# EAGLE design isg-clock-generator-rev1 (EAGLE 9.3.2)
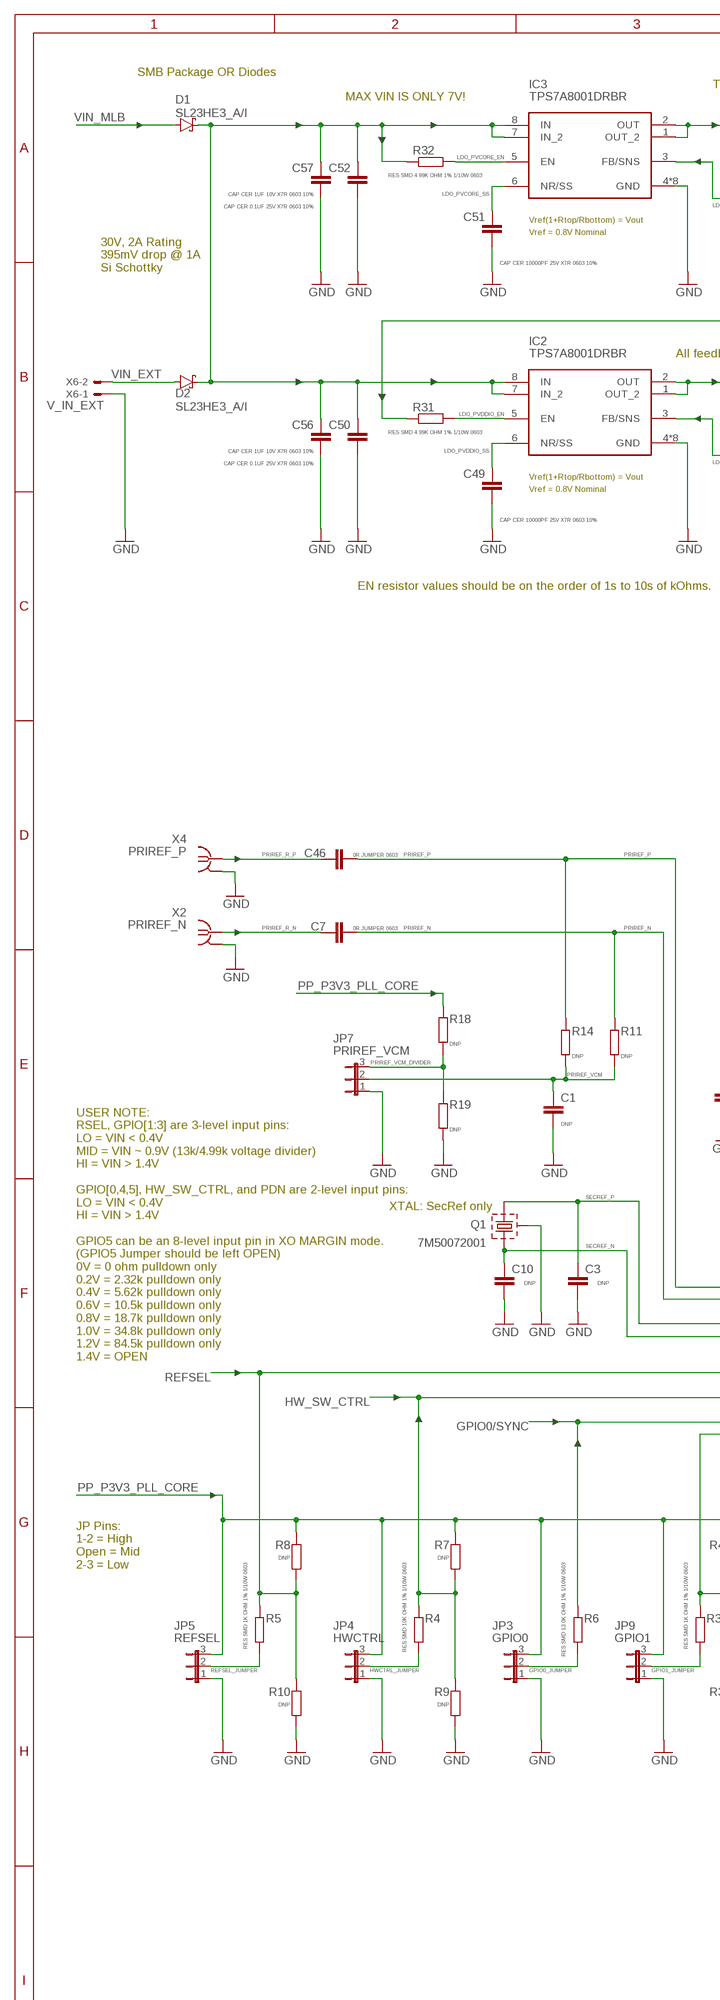
[diagram p0: schematic, sheet 1, part 1 of 2]
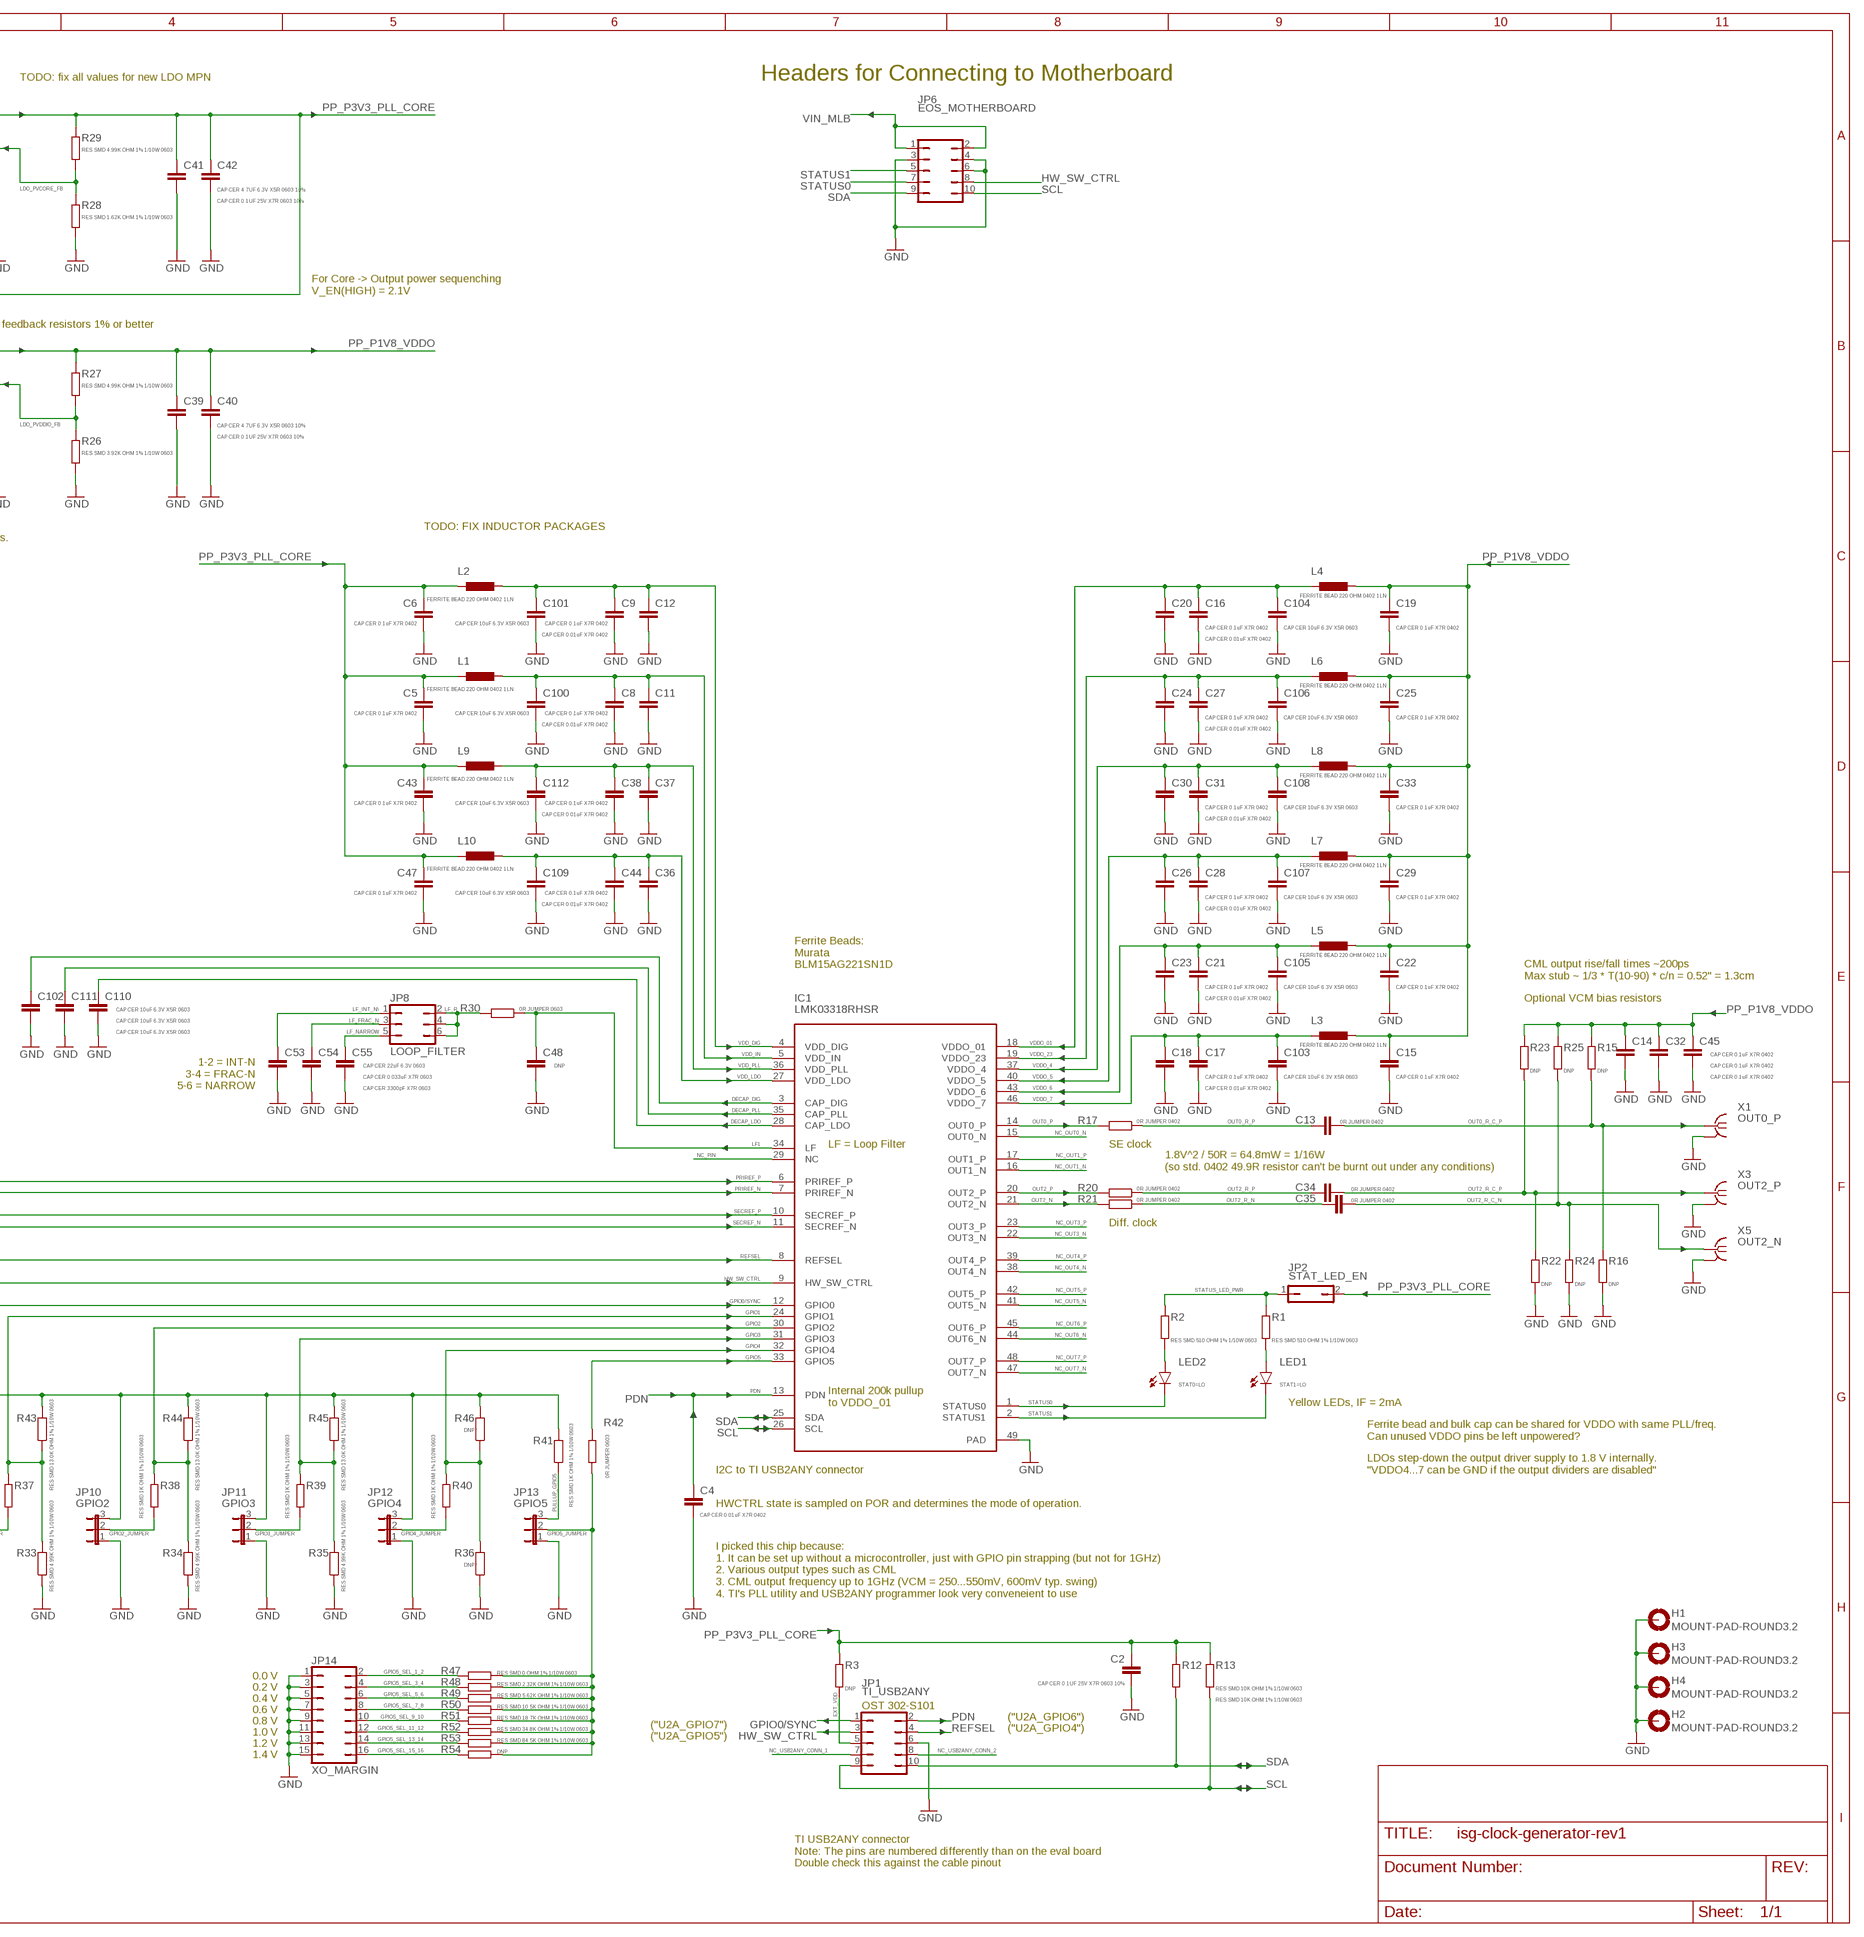
[diagram p1: schematic, sheet 1, part 2 of 2]

## Parts
C1  DNP  C-EUC0603  [C0603]
C2  CAP CER 0.1UF 25V X7R 0603 10%  C-EUC0603  [C0603]
C3  DNP  C-EUC0603  [C0603]
C4  CAP CER 0.01uF X7R 0402  C-EUC0402  [C0402]
C5  CAP CER 0.1uF X7R 0402  C-EUC0402  [C0402]
C6  CAP CER 0.1uF X7R 0402  C-EUC0402  [C0402]
C7  0R JUMPER 0603  C-EUC0603  [C0603]
C8  CAP CER 0.1uF X7R 0402  C-EUC0402  [C0402]
C9  CAP CER 0.1uF X7R 0402  C-EUC0402  [C0402]
C10  DNP  C-EUC0603  [C0603]
C11  CAP CER 0.01uF X7R 0402  C-EUC0402  [C0402]
C12  CAP CER 0.01uF X7R 0402  C-EUC0402  [C0402]
C13  0R JUMPER 0402  C-EUC0402  [C0402]
C14  CAP CER 0.1uF X7R 0402  C-EUC0402  [C0402]
C15  CAP CER 0.1uF X7R 0402  C-EUC0402  [C0402]
C16  CAP CER 0.1uF X7R 0402  C-EUC0402  [C0402]
C17  CAP CER 0.1uF X7R 0402  C-EUC0402  [C0402]
C18  CAP CER 0.01uF X7R 0402  C-EUC0402  [C0402]
C19  CAP CER 0.1uF X7R 0402  C-EUC0402  [C0402]
C20  CAP CER 0.01uF X7R 0402  C-EUC0402  [C0402]
C21  CAP CER 0.1uF X7R 0402  C-EUC0402  [C0402]
C22  CAP CER 0.1uF X7R 0402  C-EUC0402  [C0402]
C23  CAP CER 0.01uF X7R 0402  C-EUC0402  [C0402]
C24  CAP CER 0.01uF X7R 0402  C-EUC0402  [C0402]
C25  CAP CER 0.1uF X7R 0402  C-EUC0402  [C0402]
C26  CAP CER 0.01uF X7R 0402  C-EUC0402  [C0402]
C27  CAP CER 0.1uF X7R 0402  C-EUC0402  [C0402]
C28  CAP CER 0.1uF X7R 0402  C-EUC0402  [C0402]
C29  CAP CER 0.1uF X7R 0402  C-EUC0402  [C0402]
C30  CAP CER 0.01uF X7R 0402  C-EUC0402  [C0402]
C31  CAP CER 0.1uF X7R 0402  C-EUC0402  [C0402]
C32  CAP CER 0.1uF X7R 0402  C-EUC0402  [C0402]
C33  CAP CER 0.1uF X7R 0402  C-EUC0402  [C0402]
C34  0R JUMPER 0402  C-EUC0402  [C0402]
C35  0R JUMPER 0402  C-EUC0402  [C0402]
C36  CAP CER 0.01uF X7R 0402  C-EUC0402  [C0402]
C37  CAP CER 0.01uF X7R 0402  C-EUC0402  [C0402]
C38  CAP CER 0.1uF X7R 0402  C-EUC0402  [C0402]
C39  CAP CER 0.1UF 25V X7R 0603 10%  C-EUC0603  [C0603]
C40  CAP CER 4.7UF 6.3V X5R 0603 10%  C-EUC0603  [C0603]
C41  CAP CER 0.1UF 25V X7R 0603 10%  C-EUC0603  [C0603]
C42  CAP CER 4.7UF 6.3V X5R 0603 10%  C-EUC0603  [C0603]
C43  CAP CER 0.1uF X7R 0402  C-EUC0402  [C0402]
C44  CAP CER 0.1uF X7R 0402  C-EUC0402  [C0402]
C45  CAP CER 0.1uF X7R 0402  C-EUC0402  [C0402]
C46  0R JUMPER 0603  C-EUC0603  [C0603]
C47  CAP CER 0.1uF X7R 0402  C-EUC0402  [C0402]
C48  DNP  C-EUC0603  [C0603]
C49  CAP CER 10000PF 25V X7R 0603 10%  C-EUC0603  [C0603]
C50  CAP CER 0.1UF 25V X7R 0603 10%  C-EUC0603  [C0603]
C51  CAP CER 10000PF 25V X7R 0603 10%  C-EUC0603  [C0603]
C52  CAP CER 0.1UF 25V X7R 0603 10%  C-EUC0603  [C0603]
C53  CAP CER 3300pF X7R 0603  C-EUC0603  [C0603]
C54  CAP CER 0.033uF X7R 0603  C-EUC0603  [C0603]
C55  CAP CER 22uF 6.3V 0603  C-EUC0603  [C0603]
C56  CAP CER 1UF 10V X7R 0603 10%  C-EUC0603  [C0603]
C57  CAP CER 1UF 10V X7R 0603 10%  C-EUC0603  [C0603]
C100  CAP CER 10uF 6.3V X5R 0603  C-EUC0603  [C0603]
C101  CAP CER 10uF 6.3V X5R 0603  C-EUC0603  [C0603]
C102  CAP CER 10uF 6.3V X5R 0603  C-EUC0603  [C0603]
C103  CAP CER 10uF 6.3V X5R 0603  C-EUC0603  [C0603]
C104  CAP CER 10uF 6.3V X5R 0603  C-EUC0603  [C0603]
C105  CAP CER 10uF 6.3V X5R 0603  C-EUC0603  [C0603]
C106  CAP CER 10uF 6.3V X5R 0603  C-EUC0603  [C0603]
C107  CAP CER 10uF 6.3V X5R 0603  C-EUC0603  [C0603]
C108  CAP CER 10uF 6.3V X5R 0603  C-EUC0603  [C0603]
C109  CAP CER 10uF 6.3V X5R 0603  C-EUC0603  [C0603]
C110  CAP CER 10uF 6.3V X5R 0603  C-EUC0603  [C0603]
C111  CAP CER 10uF 6.3V X5R 0603  C-EUC0603  [C0603]
C112  CAP CER 10uF 6.3V X5R 0603  C-EUC0603  [C0603]
D1  SL23HE3_A/I  SCHOTTKY-DIODESMD  [SMB]
D2  SL23HE3_A/I  SCHOTTKY-DIODESMD  [SMB]
H1  MOUNT-PAD-ROUND3.2  [3,2-PAD]
H2  MOUNT-PAD-ROUND3.2  [3,2-PAD]
H3  MOUNT-PAD-ROUND3.2  [3,2-PAD]
H4  MOUNT-PAD-ROUND3.2  [3,2-PAD]
IC1  LMK03318RHSR  LMK03318RHSRRHS0048A_NV  [RHS0048A_NV]
IC2  TPS7A8001DRBR  [DRB8_1P75X1P5]
IC3  TPS7A8001DRBR  [DRB8_1P75X1P5]
JP1  TI_USB2ANY  CON_OST_302-S101  [CON_OST_302-S101]
JP2  STAT_LED_EN  JP1Q  [JP1]
JP3  GPIO0  JP2E  [JP2_ROUND]
JP4  HWCTRL  JP2E  [JP2_ROUND]
JP5  REFSEL  JP2E  [JP2_ROUND]
JP6  EOS_MOTHERBOARD  JP5Q  [JP5Q]
JP7  PRIREF_VCM  JP2E  [JP2_ROUND]
JP8  LOOP_FILTER  JP3Q  [JP3Q]
JP9  GPIO1  JP2E  [JP2_ROUND]
JP10  GPIO2  JP2E  [JP2_ROUND]
JP11  GPIO3  JP2E  [JP2_ROUND]
JP12  GPIO4  JP2E  [JP2_ROUND]
JP13  GPIO5  JP2E  [JP2_ROUND]
JP14  XO_MARGIN  JP8Q  [JP8Q]
L1  FERRITE BEAD 220 OHM 0402 1LN  INDUCTOR0402  [R0402]
L2  FERRITE BEAD 220 OHM 0402 1LN  INDUCTOR0402  [R0402]
L3  FERRITE BEAD 220 OHM 0402 1LN  INDUCTOR0402  [R0402]
L4  FERRITE BEAD 220 OHM 0402 1LN  INDUCTOR0402  [R0402]
L5  FERRITE BEAD 220 OHM 0402 1LN  INDUCTOR0402  [R0402]
L6  FERRITE BEAD 220 OHM 0402 1LN  INDUCTOR0402  [R0402]
L7  FERRITE BEAD 220 OHM 0402 1LN  INDUCTOR0402  [R0402]
L8  FERRITE BEAD 220 OHM 0402 1LN  INDUCTOR0402  [R0402]
L9  FERRITE BEAD 220 OHM 0402 1LN  INDUCTOR0402  [R0402]
L10  FERRITE BEAD 220 OHM 0402 1LN  INDUCTOR0402  [R0402]
LED1  STAT1=LO  LEDCHIP-LED0805  [CHIP-LED0805]
LED2  STAT0=LO  LEDCHIP-LED0805  [CHIP-LED0805]
Q1  7M50072001  KX-7  [3.2X2.5_KX-7]
R1  RES SMD 510 OHM 1% 1/10W 0603  R-EU_R0603  [R0603]
R2  RES SMD 510 OHM 1% 1/10W 0603  R-EU_R0603  [R0603]
R3  DNP  R-EU_R0603  [R0603]
R4  RES SMD 10K OHM 1% 1/10W 0603  R-EU_R0603  [R0603]
R5  RES SMD 1K OHM 1% 1/10W 0603  R-EU_R0603  [R0603]
R6  RES SMD 13.0K OHM 1% 1/10W 0603  R-EU_R0603  [R0603]
R7  DNP  R-EU_R0603  [R0603]
R8  DNP  R-EU_R0603  [R0603]
R9  DNP  R-EU_R0603  [R0603]
R10  DNP  R-EU_R0603  [R0603]
R11  DNP  R-EU_R0603  [R0603]
R12  RES SMD 10K OHM 1% 1/10W 0603  R-EU_R0603  [R0603]
R13  RES SMD 10K OHM 1% 1/10W 0603  R-EU_R0603  [R0603]
R14  DNP  R-EU_R0603  [R0603]
R15  DNP  R-EU_R0402  [R0402]
R16  DNP  R-EU_R0402  [R0402]
R17  0R JUMPER 0402  R-EU_R0402  [R0402]
R18  DNP  R-EU_R0603  [R0603]
R19  DNP  R-EU_R0603  [R0603]
R20  0R JUMPER 0402  R-EU_R0402  [R0402]
R21  0R JUMPER 0402  R-EU_R0402  [R0402]
R22  DNP  R-EU_R0402  [R0402]
R23  DNP  R-EU_R0402  [R0402]
R24  DNP  R-EU_R0402  [R0402]
R25  DNP  R-EU_R0402  [R0402]
R26  RES SMD 3.92K OHM 1% 1/10W 0603  R-EU_R0603  [R0603]
R27  RES SMD 4.99K OHM 1% 1/10W 0603  R-EU_R0603  [R0603]
R28  RES SMD 1.62K OHM 1% 1/10W 0603  R-EU_R0603  [R0603]
R29  RES SMD 4.99K OHM 1% 1/10W 0603  R-EU_R0603  [R0603]
R30  0R JUMPER 0603  R-EU_R0603  [R0603]
R31  RES SMD 4.99K OHM 1% 1/10W 0603  R-EU_R0603  [R0603]
R32  RES SMD 4.99K OHM 1% 1/10W 0603  R-EU_R0603  [R0603]
R33  RES SMD 4.99K OHM 1% 1/10W 0603  R-EU_R0603  [R0603]
R34  RES SMD 4.99K OHM 1% 1/10W 0603  R-EU_R0603  [R0603]
R35  RES SMD 4.99K OHM 1% 1/10W 0603  R-EU_R0603  [R0603]
R36  DNP  R-EU_R0603  [R0603]
R37  RES SMD 1K OHM 1% 1/10W 0603  R-EU_R0603  [R0603]
R38  RES SMD 1K OHM 1% 1/10W 0603  R-EU_R0603  [R0603]
R39  RES SMD 1K OHM 1% 1/10W 0603  R-EU_R0603  [R0603]
R40  RES SMD 1K OHM 1% 1/10W 0603  R-EU_R0603  [R0603]
R41  RES SMD 1K OHM 1% 1/10W 0603  R-EU_R0603  [R0603]
R42  0R JUMPER 0603  R-EU_R0603  [R0603]
R43  RES SMD 13.0K OHM 1% 1/10W 0603  R-EU_R0603  [R0603]
R44  RES SMD 13.0K OHM 1% 1/10W 0603  R-EU_R0603  [R0603]
R45  RES SMD 13.0K OHM 1% 1/10W 0603  R-EU_R0603  [R0603]
R46  DNP  R-EU_R0603  [R0603]
R47  RES SMD 0 OHM 1% 1/10W 0603  R-EU_R0603  [R0603]
R48  RES SMD 2.32K OHM 1% 1/10W 0603  R-EU_R0603  [R0603]
R49  RES SMD 5.62K OHM 1% 1/10W 0603  R-EU_R0603  [R0603]
R50  RES SMD 10.5K OHM 1% 1/10W 0603  R-EU_R0603  [R0603]
R51  RES SMD 18.7K OHM 1% 1/10W 0603  R-EU_R0603  [R0603]
R52  RES SMD 34.8K OHM 1% 1/10W 0603  R-EU_R0603  [R0603]
R53  RES SMD 84.5K OHM 1% 1/10W 0603  R-EU_R0603  [R0603]
R54  DNP  R-EU_R0603  [R0603]
X1  OUT0_P  SMA-142-0701-881/886  [J502-ND-142-0701-881/886]
X2  PRIREF_N  SMA-142-0701-881/886  [J502-ND-142-0701-881/886]
X3  OUT2_P  SMA-142-0701-881/886  [J502-ND-142-0701-881/886]
X4  PRIREF_P  SMA-142-0701-881/886  [J502-ND-142-0701-881/886]
X5  OUT2_N  SMA-142-0701-881/886  [J502-ND-142-0701-881/886]
X6  V_IN_EXT  22-23-2021  [22-23-2021]

## Nets
DECAP_DIG: C102.1 IC1.3(CAP_DIG)
DECAP_LDO: C110.1 IC1.28(CAP_LDO)
DECAP_PLL: C111.1 IC1.35(CAP_PLL)
EXT_VDD: JP1.5 R3.1
GND: C1.2 C2.2 C3.2 C4.2 C5.2 C6.2 C8.2 C9.2 C10.2 C11.2 C12.2 C14.2 C15.2 C16.2 C17.2 C18.2 C19.2 C20.2 C21.2 C22.2 C23.2 C24.2 C25.2 C26.2 C27.2 C28.2 C29.2 C30.2 C31.2 C32.2 C33.2 C36.2 C37.2 C38.2 C39.2 C40.2 C41.2 C42.2 C43.2 C44.2 C45.2 C47.2 C48.2 C49.2 C50.2 C51.2 C52.2 C53.2 C54.2 C55.2 C56.2 C57.2 C100.2 C101.2 C102.2 C103.2 C104.2 C105.2 C106.2 C107.2 C108.2 C109.2 C110.2 C111.2 C112.2 H1.B3,2(MOUNT) H2.B3,2(MOUNT) H3.B3,2(MOUNT) H4.B3,2(MOUNT) IC1.49(PAD) IC2.4(GND) IC2.PAD1(GND) IC2.PAD2(GND) IC2.PAD3(GND) IC2.PAD4(GND) IC2.PAD(GND) IC2.VIA1(GND) IC2.VIA2(GND) IC3.4(GND) IC3.PAD1(GND) IC3.PAD2(GND) IC3.PAD3(GND) IC3.PAD4(GND) IC3.PAD(GND) IC3.VIA1(GND) IC3.VIA2(GND) JP1.6 JP3.1 JP4.1 JP5.1 JP6.3 JP6.4 JP6.6 JP7.1 JP9.1 JP10.1 JP11.1 JP12.1 JP13.1 JP14.1 JP14.3 JP14.5 JP14.7 JP14.9 JP14.11 JP14.13 JP14.15 Q1.2(GND) Q1.4(GND) R9.1 R10.1 R16.1 R19.1 R22.1 R24.1 R26.2 R28.2 R33.1 R34.1 R35.1 R36.1 X1.G@1 X1.G@2 X1.G@3 X1.G@4 X2.G@1 X2.G@2 X2.G@3 X2.G@4 X3.G@1 X3.G@2 X3.G@3 X3.G@4 X4.G@1 X4.G@2 X4.G@3 X4.G@4 X5.G@1 X5.G@2 X5.G@3 X5.G@4 X6.1
GPIO0/SYNC: IC1.12(GPIO0) JP1.1 R6.2
GPIO0_JUMPER: JP3.2 R6.1
GPIO1: IC1.24(GPIO1) R33.2 R37.2 R43.1
GPIO1_JUMPER: JP9.2 R37.1
GPIO2: IC1.30(GPIO2) R34.2 R38.2 R44.1
GPIO2_JUMPER: JP10.2 R38.1
GPIO3: IC1.31(GPIO3) R35.2 R39.2 R45.1
GPIO3_JUMPER: JP11.2 R39.1
GPIO4: IC1.32(GPIO4) R36.2 R40.2 R46.1
GPIO4_JUMPER: JP12.2 R40.1
GPIO5: IC1.33(GPIO5) R42.1
GPIO5_JUMPER: JP13.2 R42.2 R47.1 R48.1 R49.1 R50.1 R51.1 R52.1 R53.1 R54.1
GPIO5_SEL_1_2: JP14.2 R47.2
GPIO5_SEL_3_4: JP14.4 R48.2
GPIO5_SEL_5_6: JP14.6 R49.2
GPIO5_SEL_7_8: JP14.8 R50.2
GPIO5_SEL_9_10: JP14.10 R51.2
GPIO5_SEL_11_12: JP14.12 R52.2
GPIO5_SEL_13_14: JP14.14 R53.2
GPIO5_SEL_15_16: JP14.16 R54.2
HW_SW_CTRL: IC1.9(HW_SW_CTRL) JP1.3 JP6.8 R4.2 R7.1 R9.2
HWCTRL_JUMPER: JP4.2 R4.1
LDO_PVCORE_EN: IC3.5(EN) R32.2
LDO_PVCORE_FB: IC3.3(FB/SNS) R28.1 R29.1
LDO_PVCORE_SS: C51.1 IC3.6(NR/SS)
LDO_PVDDIO_EN: IC2.5(EN) R31.2
LDO_PVDDIO_FB: IC2.3(FB/SNS) R26.1 R27.1
LDO_PVDDIO_SS: C49.1 IC2.6(NR/SS)
LF1: C48.1 IC1.34(LF) R30.1
LF_FRAC_N: C54.1 JP8.3
LF_INT_N\: C53.1 JP8.1
LF_NARROW: C55.1 JP8.5
LF_R: JP8.2 JP8.4 JP8.6 R30.2
N$7: LED1.A R1.1
N$8: LED2.A R2.1
NC_OUT0_N: IC1.15(OUT0_N)
NC_OUT1_N: IC1.16(OUT1_N)
NC_OUT1_P: IC1.17(OUT1_P)
NC_OUT3_N: IC1.22(OUT3_N)
NC_OUT3_P: IC1.23(OUT3_P)
NC_OUT4_N: IC1.38(OUT4_N)
NC_OUT4_P: IC1.39(OUT4_P)
NC_OUT5_N: IC1.41(OUT5_N)
NC_OUT5_P: IC1.42(OUT5_P)
NC_OUT6_N: IC1.44(OUT6_N)
NC_OUT6_P: IC1.45(OUT6_P)
NC_OUT7_N: IC1.47(OUT7_N)
NC_OUT7_P: IC1.48(OUT7_P)
NC_PIN: IC1.29(NC)
NC_USB2ANY_CONN_1: JP1.7
NC_USB2ANY_CONN_2: JP1.8
OUT0_P: IC1.14(OUT0_P) R17.2
OUT0_R_C_P: C13.2 R15.1 R16.2 X1.1
OUT0_R_P: C13.1 R17.1
OUT2_N: IC1.21(OUT2_N) R21.2
OUT2_P: IC1.20(OUT2_P) R20.2
OUT2_R_C_N: C35.2 R24.2 R25.1 X5.1
OUT2_R_C_P: C34.2 R22.2 R23.1 X3.1
OUT2_R_N: C35.1 R21.1
OUT2_R_P: C34.1 R20.1
PDN: C4.1 IC1.13(PDN) JP1.2
PP_P1V8_VDDO: C14.1 C15.1 C19.1 C22.1 C25.1 C29.1 C32.1 C33.1 C39.1 C40.1 C45.1 IC2.1(OUT_2) IC2.2(OUT) L3.2 L4.2 L5.2 L6.2 L7.2 L8.2 R15.2 R23.2 R25.2 R27.2
PP_P3V3_PLL_CORE: C2.1 C5.1 C6.1 C41.1 C42.1 C43.1 C47.1 IC3.1(OUT_2) IC3.2(OUT) JP2.2 JP3.3 JP4.3 JP5.3 JP9.3 JP10.3 JP11.3 JP12.3 L1.1 L2.1 L9.1 L10.1 R3.2 R7.2 R8.2 R12.2 R13.2 R18.2 R29.2 R31.1 R41.2 R43.2 R44.2 R45.2 R46.2
PRIREF_N: C7.2 IC1.7(PRIREF_N) R11.2
PRIREF_P: C46.2 IC1.6(PRIREF_P) R14.2
PRIREF_R_N: C7.1 X2.1
PRIREF_R_P: C46.1 X4.1
PRIREF_VCM: C1.1 JP7.2 R11.1 R14.1
PRIREF_VCM_DIVIDER: JP7.3 R18.1 R19.2
PULLUP_GPIO5: JP13.3 R41.1
REFSEL: IC1.8(REFSEL) JP1.4 R5.2 R8.1 R10.2
REFSEL_JUMPER: JP5.2 R5.1
SCL: IC1.26(SCL) JP1.9 JP6.10 R13.1
SDA: IC1.25(SDA) JP1.10 JP6.9 R12.1
SECREF_N: C10.1 IC1.11(SECREF_N) Q1.1
SECREF_P: C3.1 IC1.10(SECREF_P) Q1.3
STATUS0: IC1.1(STATUS0) JP6.7 LED2.C
STATUS1: IC1.2(STATUS1) JP6.5 LED1.C
STATUS_LED_PWR: JP2.1 R1.2 R2.2
VDD_DIG: C9.1 C12.1 C101.1 IC1.4(VDD_DIG) L2.2
VDD_IN: C8.1 C11.1 C100.1 IC1.5(VDD_IN) L1.2
VDD_LDO: C36.1 C44.1 C109.1 IC1.27(VDD_LDO) L10.2
VDD_PLL: C37.1 C38.1 C112.1 IC1.36(VDD_PLL) L9.2
VDDO_01: C16.1 C20.1 C104.1 IC1.18(VDDO_01) L4.1
VDDO_4: C30.1 C31.1 C108.1 IC1.37(VDDO_4) L8.1
VDDO_5: C26.1 C28.1 C107.1 IC1.40(VDDO_5) L7.1
VDDO_6: C21.1 C23.1 C105.1 IC1.43(VDDO_6) L5.1
VDDO_7: C17.1 C18.1 C103.1 IC1.46(VDDO_7) L3.1
VDDO_23: C24.1 C27.1 C106.1 IC1.19(VDDO_23) L6.1
VIN: C50.1 C52.1 C56.1 C57.1 D1.C D2.C IC2.7(IN_2) IC2.8(IN) IC3.7(IN_2) IC3.8(IN) R32.1
VIN_EXT: D2.A X6.2
VIN_MLB: D1.A JP6.1 JP6.2

## Notes on the sheet
- SMB Package OR Diodes
- TODO: fix all values for new LDO MPN | Headers for Connecting to Motherboard
- MAX VIN IS ONLY 7V!
- Vref(1+Rtop/Rbottom) = Vout
- Vref = 0.8V Nominal
- 30V, 2A Rating
  395mV drop @ 1A
  Si Schottky
- For Core -> Output power sequenching
  V_EN(HIGH) = 2.1V
- All feedback resistors 1% or better
- Vref(1+Rtop/Rbottom) = Vout
- Vref = 0.8V Nominal
- TODO: FIX INDUCTOR PACKAGES
- EN resistor values should be on the order of 1s to 10s of kOhms.
- Ferrite Beads:
  Murata
  BLM15AG221SN1D
- CML output rise/fall times ~200ps
  Max stub ~ 1/3 * T(10-90) * c/n = 0.52" = 1.3cm
- Optional VCM bias resistors
- 1-2 = INT-N
  3-4 = FRAC-N
  5-6 = NARROW
- XTAL: SecRef only
- LF = Loop Filter | SE clock
- 1.8V^2 / 50R = 64.8mW = 1/16W
  (so std. 0402 49.9R resistor can't be burnt out under any conditions)
- Diff. clock
- USER NOTE:
  RSEL, GPIO[1:3] are 3-level input pins:
  LO = VIN < 0.4V
  MID = VIN ~ 0.9V (13k/4.99k voltage divider)
  HI = VIN > 1.4V
  
  GPIO[0,4,5], HW_SW_CTRL, and PDN are 2-level input pins:
  LO = VIN < 0.4V
  HI = VIN > 1.4V
  
  GPIO5 can be an 8-level input pin in XO MARGIN mode.
  (GPIO5 Jumper should be left OPEN)
  0V = 0 ohm pulldown only
  0.2V = 2.32k pulldown only
  0.4V = 5.62k pulldown only
  0.6V = 10.5k pulldown only
  0.8V = 18.7k pulldown only
  1.0V = 34.8k pulldown only
  1.2V = 84.5k pulldown only
  1.4V = OPEN
- Internal 200k pullup
  to VDDO_01
- Yellow LEDs, IF = 2mA
- JP Pins:
  1-2 = High
  Open = Mid
  2-3 = Low
- Ferrite bead and bulk cap can be shared for VDDO with same PLL/freq.
  Can unused VDDO pins be left unpowered?
- I2C to TI USB2ANY connector
- LDOs step-down the output driver supply to 1.8 V internally.
  "VDDO4...7 can be GND if the output dividers are disabled"
- HWCTRL state is sampled on POR and determines the mode of operation.
- I picked this chip because:
  1. It can be set up without a microcontroller, just with GPIO pin strapping (but not for 1GHz)
  2. Various output types such as CML
  3. CML output frequency up to 1GHz (VCM = 250...550mV, 600mV typ. swing)
  4. TI's PLL utility and USB2ANY programmer look very conveneient to use
- 0.0 V
- 0.2 V
- 0.4 V
- 0.6 V | OST 302-S101
- 0.8 V | ("U2A_GPIO7") | ("U2A_GPIO6")
- 1.0 V | ("U2A_GPIO5") | ("U2A_GPIO4")
- 1.2 V
- 1.4 V
- TI USB2ANY connector
  Note: The pins are numbered differently than on the eval board
  Double check this against the cable pinout

## Library data of the parts
C1-C57 C100-C112 = rcl-modified-footprints:C-EU: CAPACITOR, European symbol
D1 D2 = diode:SCHOTTKY-DIODE: Schottky Diode
H1-H4 = holes:MOUNT-PAD-ROUND: MOUNTING PAD, round
IC1 = isg-clock-generator:LMK03318RHSR
IC2 IC3 = isg-clock-generator:TPS7A8001DRBR
JP1 = Kramnik's Library:CON_OST_302-S101
JP2 = jumper:JP1Q: JUMPER
JP3-JP5 JP7 JP9-JP13 = isg-clock-generator:JP2E: JUMPER
JP6 = isg-clock-generator:JP5Q: JUMPER
JP8 = isg-clock-generator:JP3Q: JUMPER
JP14 = isg-clock-generator:JP8Q: JUMPER
L1-L10 = meng:INDUCTOR
LED1 LED2 = led:LED: LED OSRAM: - CHIPLED LG R971, LG N971, LY N971, LG Q971, LY Q971, LO R971, LY R971 LH N974, LH R974 LS Q976, LO Q976, LY Q976 LO Q996 - Hyper CHIPLED LW Q18S LB Q993, LB Q99A, LB R99A - SideLED LS A670, LO A670, LY A670, LG A670, LP A670 LB A673, LV A673, LT A673, LW A673 LH A674 LY A675 LS A676, LA A676, LO A676, LY A676, LW A676 LS A679, LY A679, LG A679 - Hyper Micro SIDELED® LS Y876, LA Y876, LO Y876, LY Y876 LT Y87S - SmartLED LW L88C, LW L88S LB L89C, LB L89S, LG L890 LS L89K, LO L89K, LY L89K LS L896, LA L896, LO L896, LY L896 - TOPLED LS T670, LO T670, LY T670, LG T670, LP T670 LSG T670, LSP T670, LSY T670, LOP T670, LYG T670 LG T671, LOG T671, LSG T671 LB T673, LV T673, LT T673, LW T673 LH T674 LS T676, LA T676, LO T676, LY T676, LB T676, LH T676, LSB T676, LW T676 LB T67C, LV T67C, LT T67C, LS T67K, LO T67K, LY T67K, LW E67C LS E67B, LA E67B, LO E67B, LY E67B, LB E67C, LV E67C, LT E67C LW T67C LS T679, LY T679, LG T679 LS T770, LO T770, LY T770, LG T770, LP T770 LB T773, LV T773, LT T773, LW T773 LH T774 LS E675, LA E675, LY E675, LS T675 LS T776, LA T776, LO T776, LY T776, LB T776 LHGB T686 LT T68C, LB T68C - Hyper Mini TOPLED® LB M676 - Mini TOPLED Santana® LG M470 LS M47K, LO M47K, LY M47K Source: http://www.osram.convergy.de LUXEON: - LUMILED® LXK2-PW12-R00, LXK2-PW12-S00, LXK2-PW14-U00, LXK2-PW14-V00 LXK2-PM12-R00, LXK2-PM12-S00, LXK2-PM14-U00 LXK2-PE12-Q00, LXK2-PE12-R00, LXK2-PE12-S00, LXK2-PE14-T00, LXK2-PE14-U00 LXK2-PB12-K00, LXK2-PB12-L00, LXK2-PB12-M00, LXK2-PB14-N00, LXK2-PB14-P00, LXK2-PB14-Q00 LXK2-PR12-L00, LXK2-PR12-M00, LXK2-PR14-Q00, LXK2-PR14-R00 LXK2-PD12-Q00, LXK2-PD12-R00, LXK2-PD12-S00 LXK2-PH12-R00, LXK2-PH12-S00 LXK2-PL12-P00, LXK2-PL12-Q00, LXK2-PL12-R00 Source: www.luxeon.com KINGBRIGHT: KA-3528ASYC Source: www.kingbright.com
Q1 = isg-clock-generator:KX: Quartz Crystals (MHz) SMD: KX - Serie Model Size l/w/h [mm] Frequency Range Frequency Stability Temp. Range [°C] Load Capacitance AECQ 200 availabel Datasheet KX-4 KX-5 KX-6 KX-7 KX-9A KX-9B KX-12A KX-12B KX-13 KX-20 KX-K KX-KS 1.6/1.2/0.3 2.0/1.6/0.45 2.5/2.0/0.55 3.2/2.5/0.8 5.0/3.2/1.0 5.0/3.2/1.1 6.0/3.5/1.1 6.0/3.5/1.0 7.0/5.0 /1.3 11.6/5.5/1.6 12.3/4.5/4.2 12.3/4.5/3.2 24.0 ~ 80.0 MHz 16.0 ~ 80.0 MHz 12.0 ~ 80.0 MHz 8.0 ~ 60.0 MHz 7,68 ~ 300,0 MHz 8,0 ~ 50,0 MHz 8,0 ~ 150,0 MHz 8,0 ~ 50,0 MHz 6,0 ~ 160,0 MHz 3,579 ~ 25,0 MHz 3,579 ~ 70,0 MHz 3,579 ~ 70,0 MHz ±10 … ±50ppm ±10 … ±50ppm ±10 … ±50ppm ±10 … ±50ppm ±10 … ±50ppm ±10 … ±50ppm ±10 … ±50ppm ±10 … ±50ppm ±10 … ±50ppm ±50ppm ±10 … ±50ppm ±10 … ±50ppm (*) -40°C …+85°C (*) -40°C …+125°C (*) -40°C …+125°C (*) -40°C …+125°C (*) -40°C …+105°C (*) -40°C …+105°C (*) -40°C …+125°C (*) -40°C …+105°C (*) -40°C …+105°C (*) -40°C …+105°C (*) -40°C …+85°C (*) -40°C …+85°C 8, 8…16 8, 8…16 10, 8…16 12, 7…20 16, 10…20 16, 10…20 16, 10…20 16, 12…20 16, 12…20 16, 12…20 16, 12…30 16, 12…30 - yes yes yes - - - - - - - - KX-4.pdf <http://www.geyer-electronic.de/uploads/tx_userartikelfrequenz/GEYER-KX-4.pdf> KX-5.pdf <http://www.geyer-electronic.de/uploads/tx_userartikelfrequenz/GEYER-KX-5.pdf> KX-6.pdf <http://www.geyer-electronic.de/uploads/tx_userartikelfrequenz/GEYER-KX-6.pdf> KX-7.pdf <http://www.geyer-electronic.de/uploads/tx_userartikelfrequenz/GEYER-KX-7.pdf> KX-9A.pdf <http://www.geyer-electronic.de/uploads/tx_userartikelfrequenz/GEYER-KX-9A.pdf> KX-9B.pdf <http://www.geyer-electronic.de/uploads/tx_userartikelfrequenz/GEYER-KX-9B.pdf> KX-12A.pdf <http://www.geyer-electronic.de/uploads/tx_userartikelfrequenz/GEYER-KX-12A.pdf> KX-12B.pdf <http://www.geyer-electronic.de/uploads/tx_userartikelfrequenz/GEYER-KX-12B.pdf> KX-13.pdf <http://www.geyer-electronic.de/uploads/tx_userartikelfrequenz/GEYER-KX-13.pdf> KX-20.pdf <http://www.geyer-electronic.de/uploads/tx_userartikelfrequenz/GEYER-KX-20.pdf> KX-K.pdf <http://www.geyer-electronic.de/uploads/tx_userartikelfrequenz/GEYER-KX-K.pdf> KX-KS.pdf <http://www.geyer-electronic.de/uploads/tx_userartikelfrequenz/GEYER-KX-KS.pdf> <http://www.geyer-electronic.de/fileadmin/template/img/logo-geyer-electronic.png> Details see: http://www.geyer-electronic.de/Frequenz-Produkte.9.0.html Created 2016-06-07, Hans Locher 2016 (C) Geyer Quartz Technology KX4,KX5,KX6,KX7,KX9A,KX9B,KX12A,KX12B,KX13,KX20,KXK,KXKS;1612;2016;2520;3225;5032;6035;7050;11655;12345;1,6x1,2;2,0x1,6;2,5x2,0;3,2x2,5;5,0x3,2;6,0x3,5;7,0x5,0;11,6x5,5;12,3x4,5;12,3x4,5;1.6x1.2;2.0x1.6;2.5x2.0;3.2x2.5;5.0x3.2;6.0x3.5;7.0x5.0;11.6x5.5;12.3x4.5;12.3x4.5;
R1-R54 = rcl-modified-footprints:R-EU_: RESISTOR, European symbol
X1-X5 = con-coax:SMA-: SMA 50 Ohm End Launch Jack Receptacle - Round Contact Johnson Components Source: www.johnsoncomponents.com .. J502-ND.pdf; MF: JOHNSON COMPONENTS; MPN: 142-0701-881; OC_FARNELL: 1608603; OC_NEWARK: 08B906
X6 = con-molex:22-23-2021: .100" (2.54mm) Center Header - 2 Pin; MF: MOLEX; MPN: 22-23-2021; OC_FARNELL: 1462926; OC_NEWARK: 25C3832

## Board
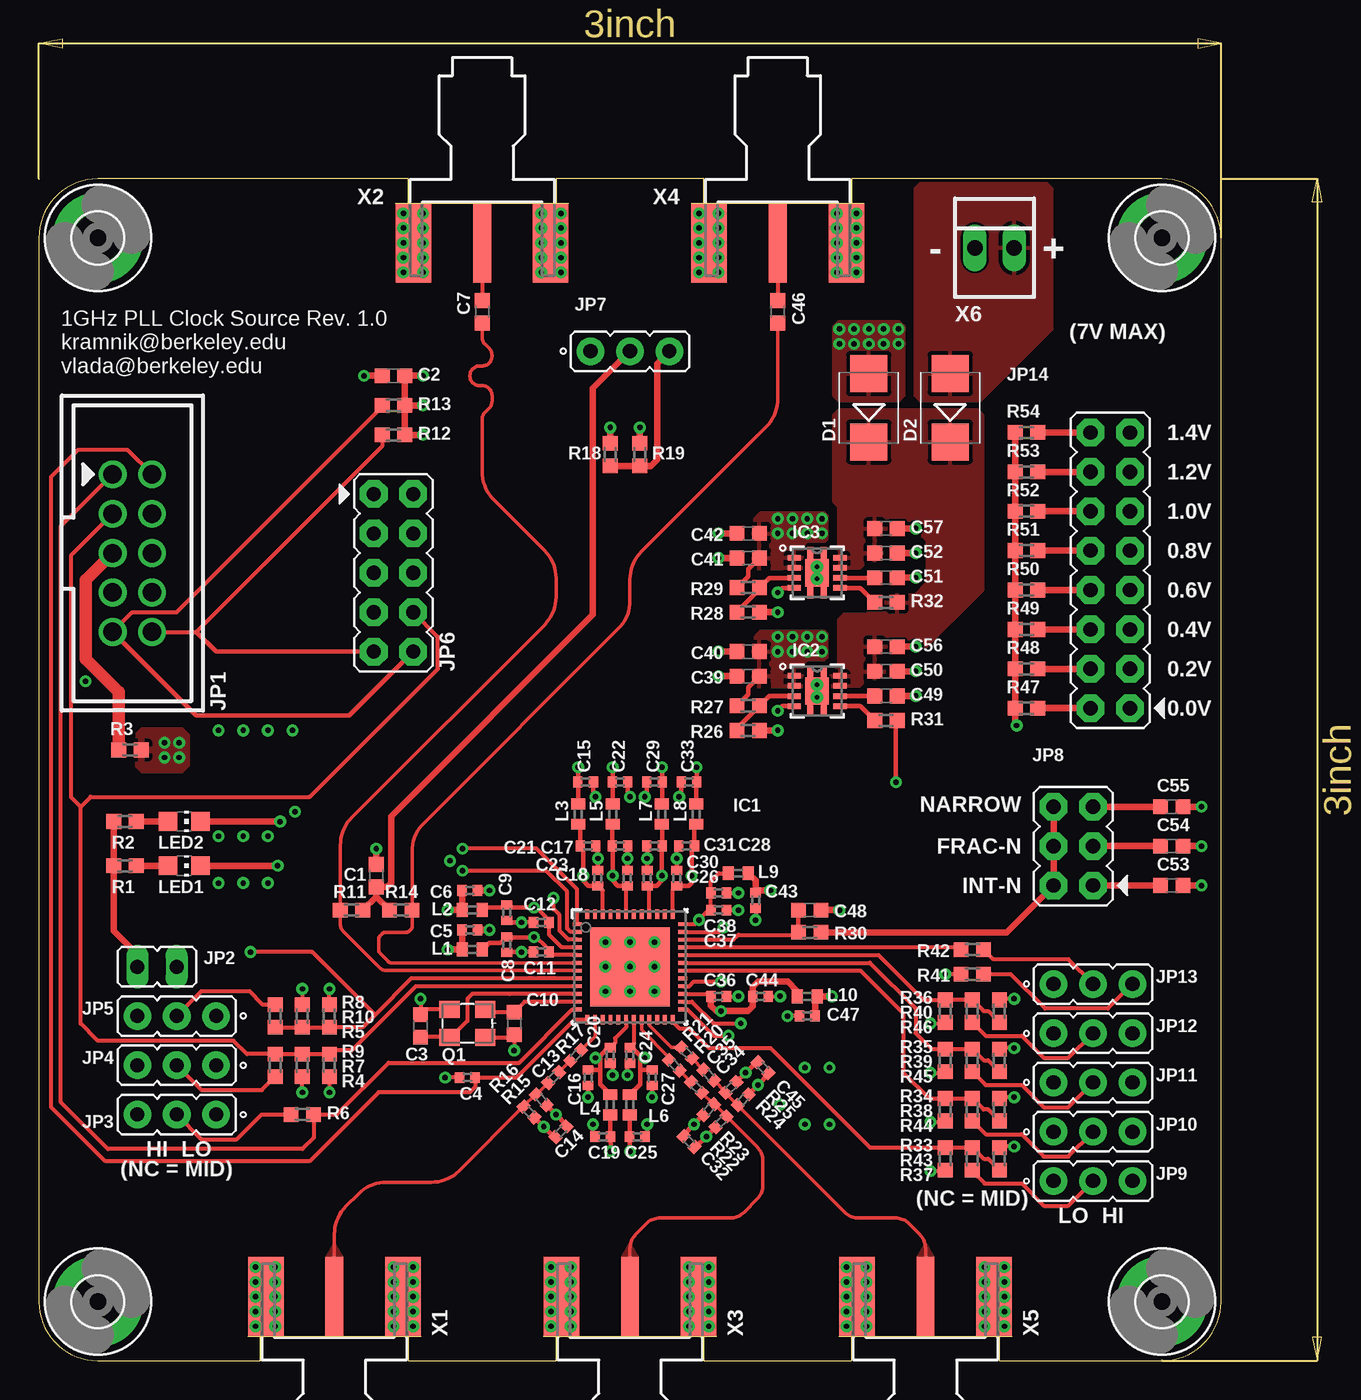
[diagram p2: board, top side]
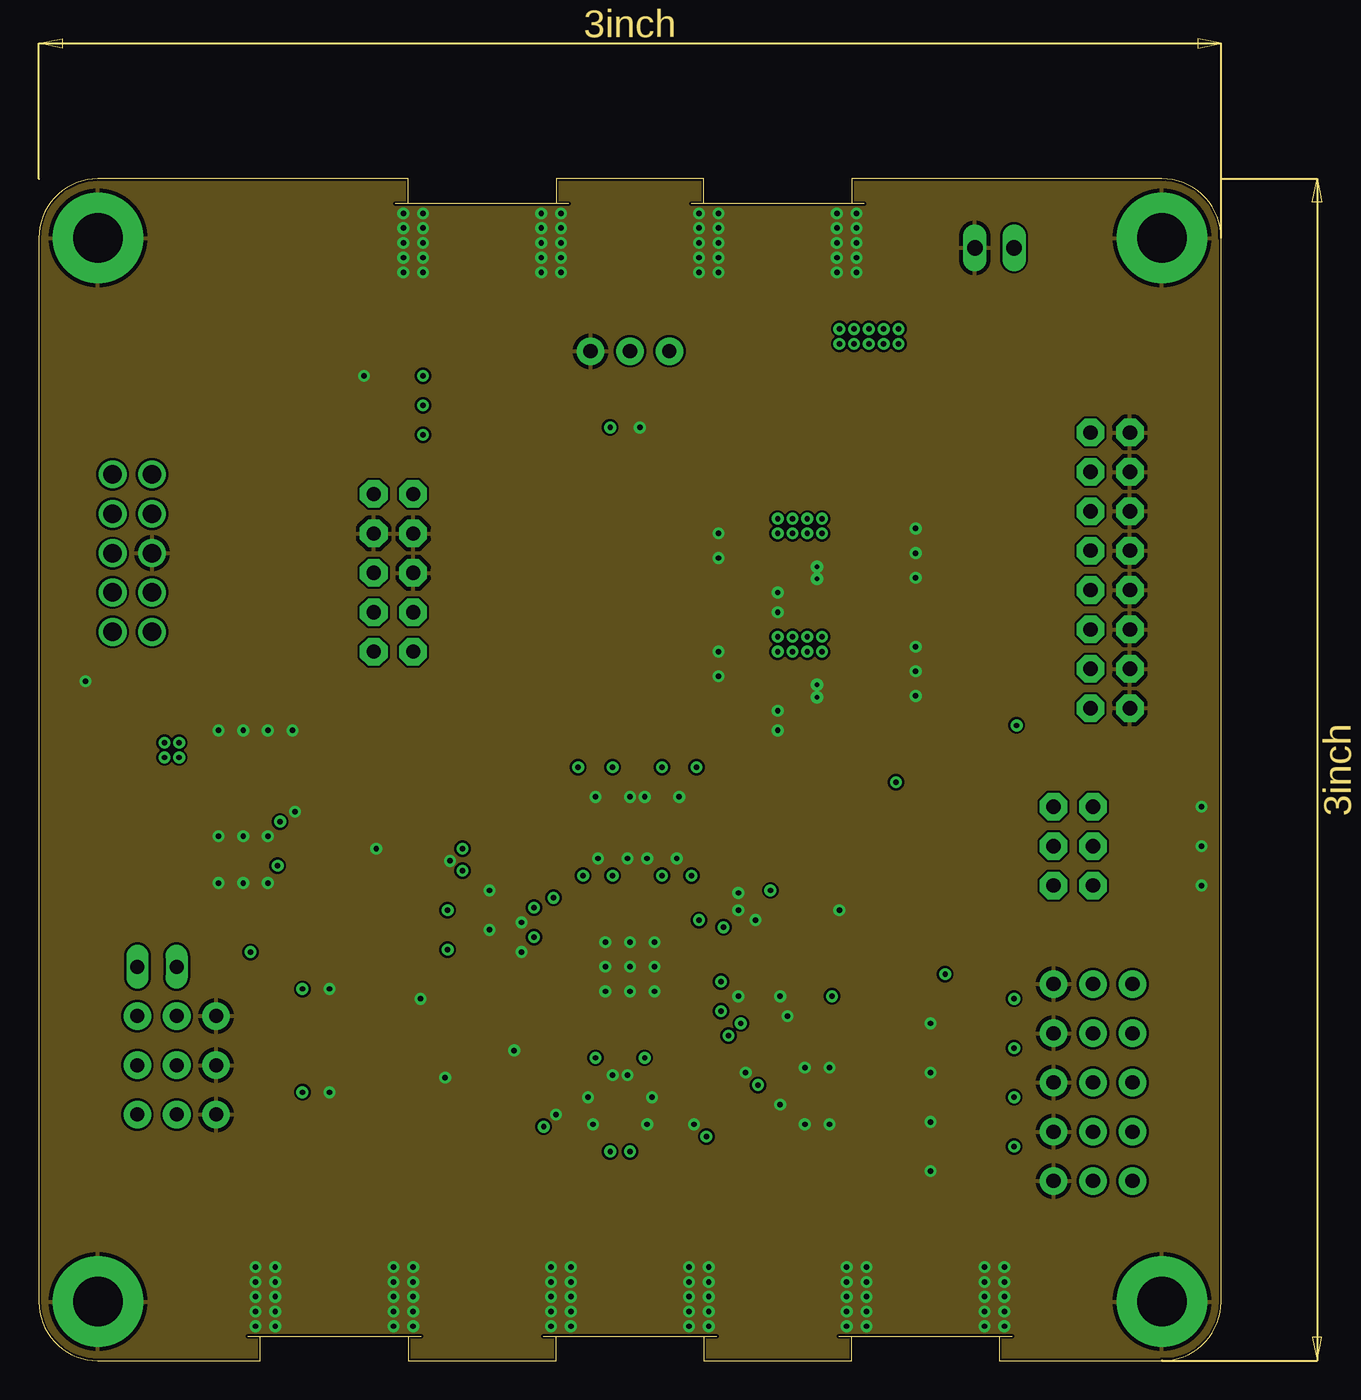
[diagram p3: board, inner layer Route2]
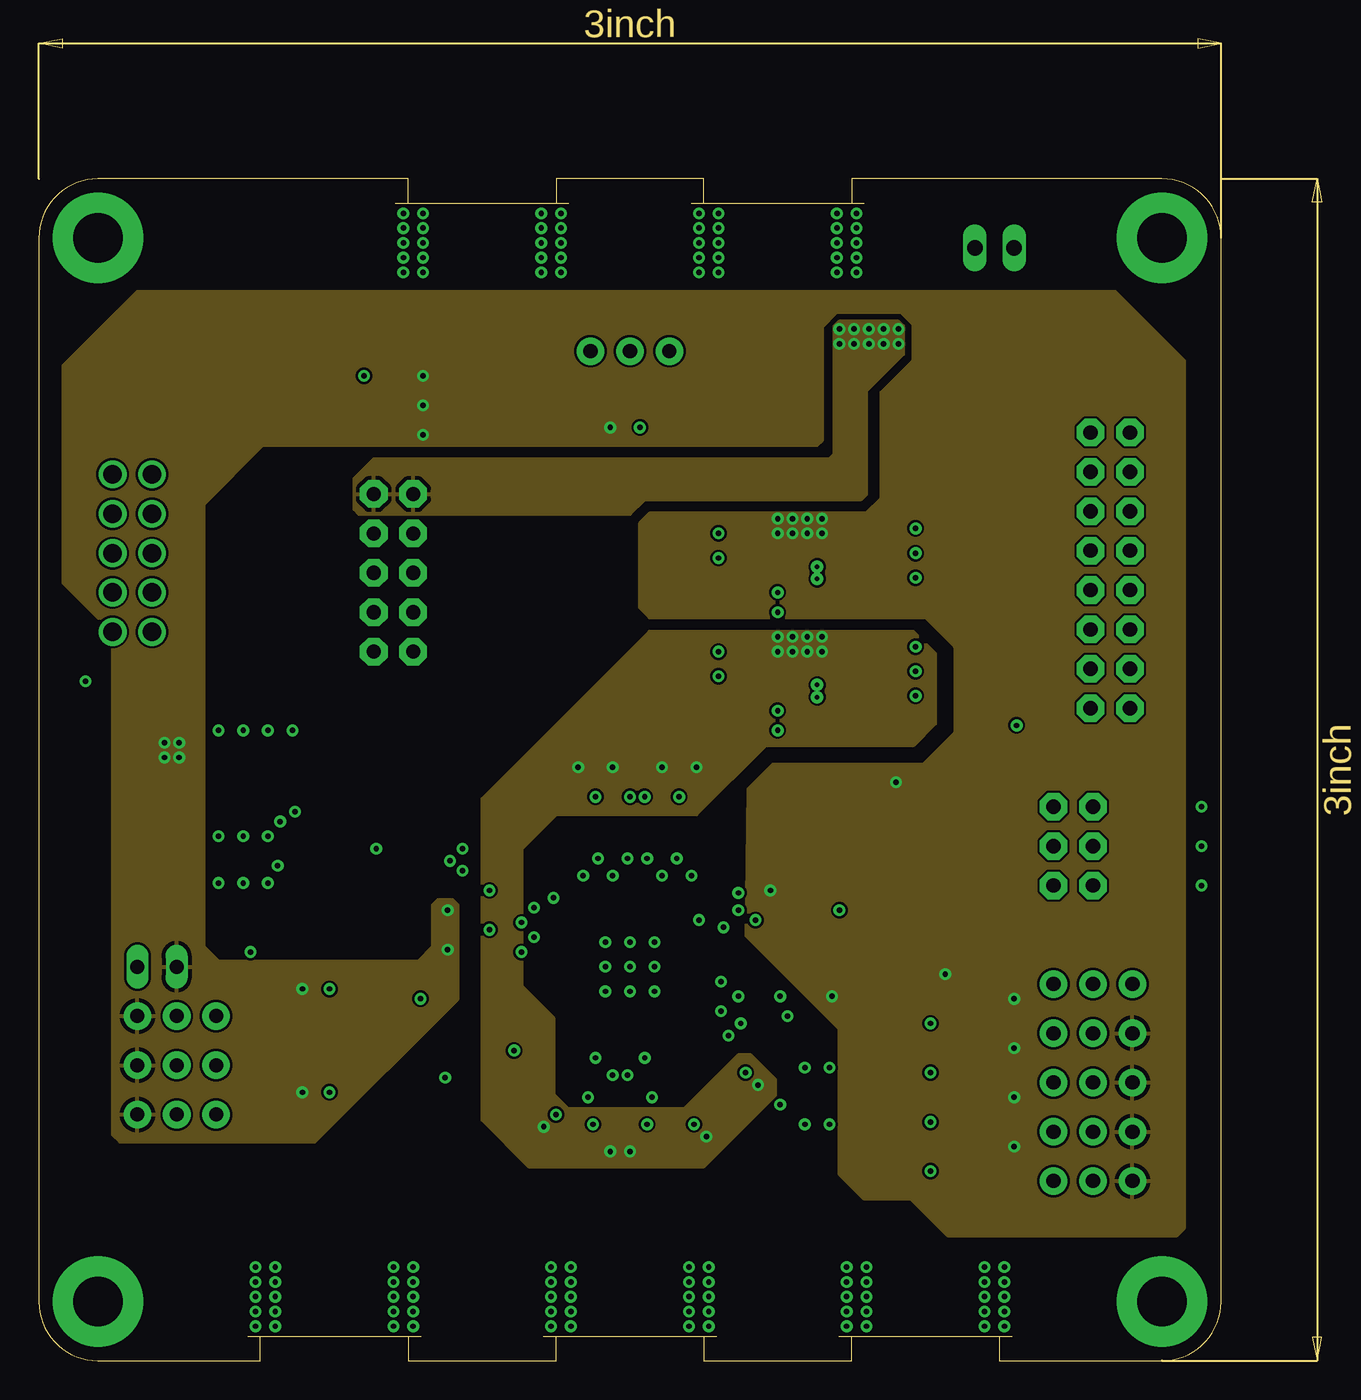
[diagram p4: board, inner layer Route15]
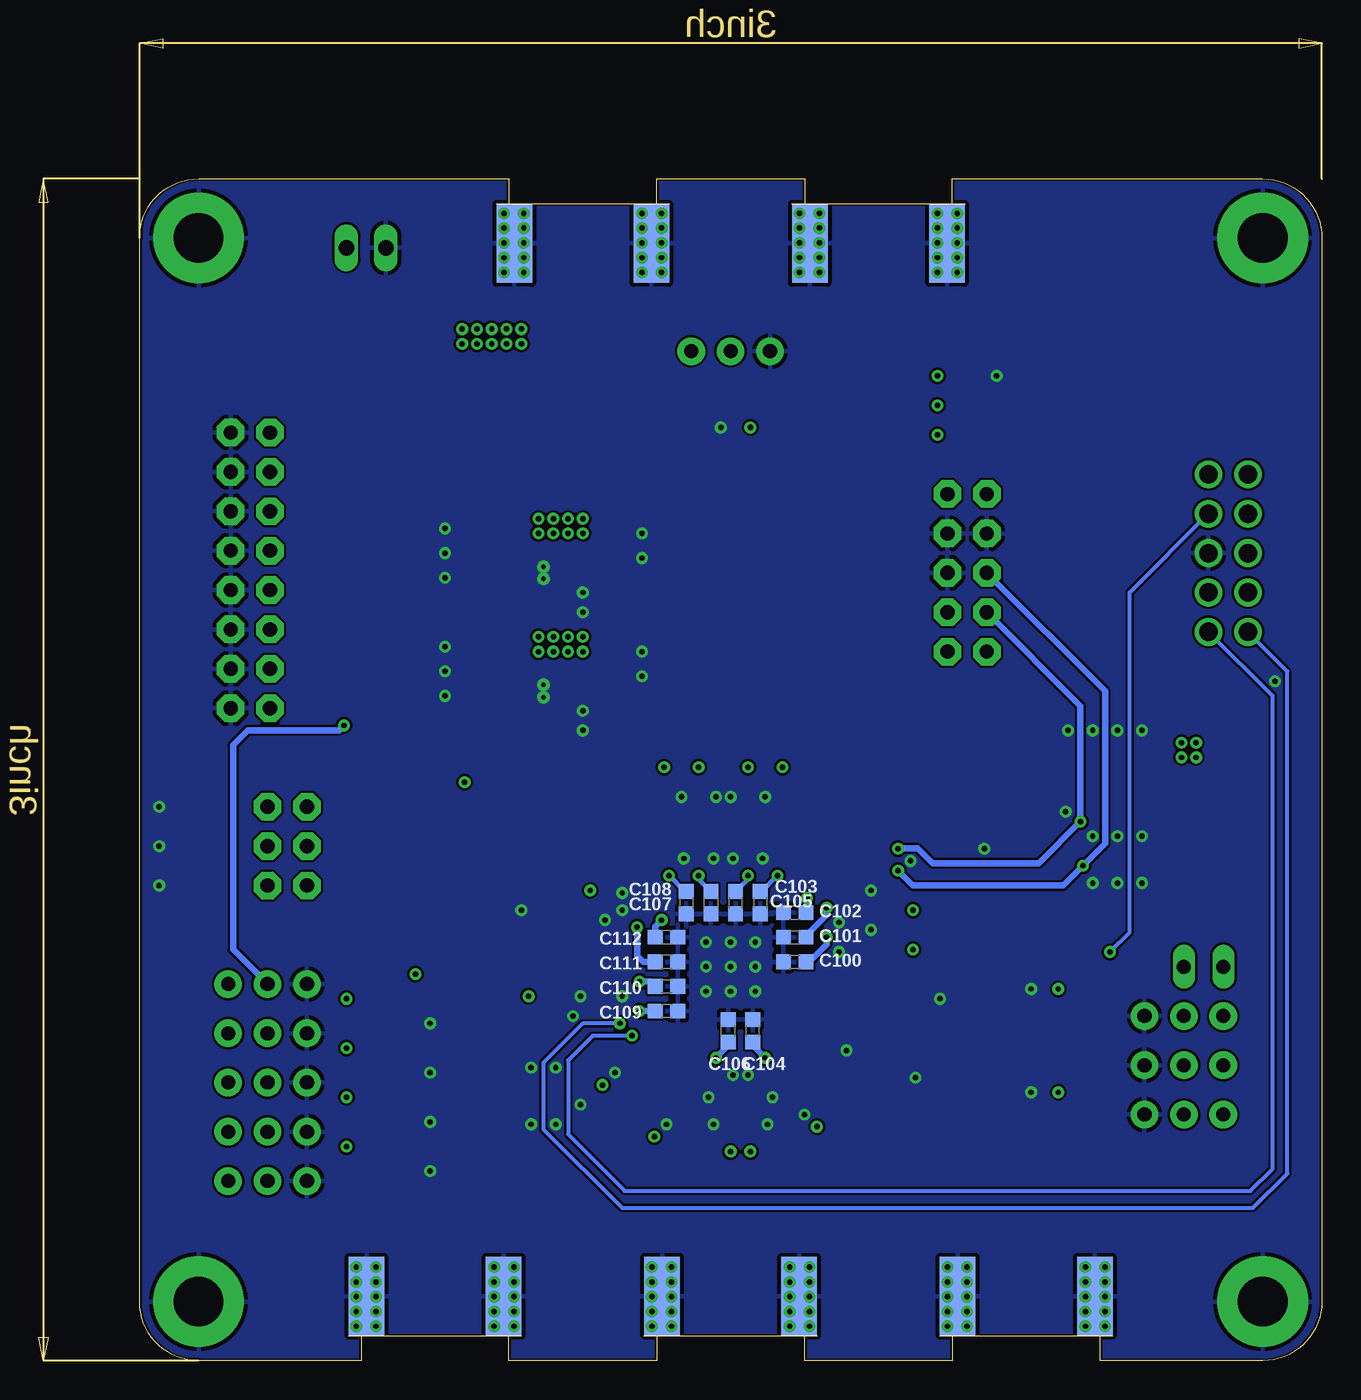
[diagram p5: board, bottom side, seen from below]

Size 76.2 x 76.2 mm. Coordinates in mm from the lower left corner, seen from the top.
Outline: 0,72.39 0,3.81 arc90 3.81,0 14.29,0 14.29,1.59 23.81,1.59 23.81,0 33.34,0 33.34,1.59 42.86,1.59 42.86,0 52.39,0 52.39,1.59 61.91,1.59 61.91,0 72.39,0 arc90 76.2,3.81 76.2,72.39 arc90 72.39,76.2 52.39,76.2 52.39,74.61 42.86,74.61 42.86,76.2 33.34,76.2 33.34,74.61 23.81,74.61 23.81,76.2 3.81,76.2 arc90 0,72.39
Copper layers (1+2*15+16): Top 0.035mm / dielectric 1.5mm / Route2 0.035mm / dielectric 0.15mm / Route15 0.035mm / dielectric 0.2mm / Bottom 0.035mm
Design rules "default *": minimum track width 6mil, minimum drill 0.3mm, track to track 6mil, track to pad 6mil, pad to pad 6mil, via to via 6mil, smd to smd 0mil, copper to edge 6mil, drill to drill 6mil, minimum pad ring 10mil, minimum via ring 8mil, stop-mask expansion 2mil, vias tented up to drill 20mil, thermal gap 10mil

### Footprints (pad centres in the part's own frame; a part is rotated, then mirrored left to right if it is on the bottom)
C0603 = smd 0.95 x 0.95: 1 -0.725,0; 2 0.725,0
C0402 = smd 0.6 x 0.7: 1 -0.5,0; 2 0.5,0
SMB = smd 2.4 x 2.4: A 2.2,0; C -2.2,0
3,2-PAD = drill 3.2 pad 5.842: B3,2 0,0
RHS0048A_NV = smd 0.6 x 0.25: 1 -3.4,2.75; 2 -3.4,2.25; 3 -3.4,1.75; 4 -3.4,1.25; 5 -3.4,0.75; 6 -3.4,0.25; 7 -3.4,-0.25; 8 -3.4,-0.75; 9 -3.4,-1.25; 10 -3.4,-1.75; 11 -3.4,-2.25; 12 -3.4,-2.75; 25 3.4,-2.75; 26 3.4,-2.25; 27 3.4,-1.75; 28 3.4,-1.25; 29 3.4,-0.75; 30 3.4,-0.25; 31 3.4,0.25; 32 3.4,0.75; 33 3.4,1.25; 34 3.4,1.75; 35 3.4,2.25; 36 3.4,2.75 | smd 0.25 x 0.6: 13 -2.75,-3.4; 14 -2.25,-3.4; 15 -1.75,-3.4; 16 -1.25,-3.4; 17 -0.75,-3.4; 18 -0.25,-3.4; 19 0.25,-3.4; 20 0.75,-3.4; 21 1.25,-3.4; 22 1.75,-3.4; 23 2.25,-3.4; 24 2.75,-3.4; 37 2.75,3.4; 38 2.25,3.4; 39 1.75,3.4; 40 1.25,3.4; 41 0.75,3.4; 42 0.25,3.4; 43 -0.25,3.4; 44 -0.75,3.4; 45 -1.25,3.4; 46 -1.75,3.4; 47 -2.25,3.4; 48 -2.75,3.4 | smd 5.1 x 5.1: 49 0,0
DRB8_1P75X1P5 = smd 0.85 x 0.35: 1 -1.475,0.975; 2 -1.475,0.325; 3 -1.475,-0.325; 4 -1.475,-0.975; 5 1.475,-0.975; 6 1.475,-0.325; 7 1.475,0.325; 8 1.475,0.975 | smd 1.5 x 1.75: PAD 0,0 | smd 0.381 x 0.965: PAD1 -0.432,-1.168; PAD2 0.432,-1.168; PAD3 0.432,1.168; PAD4 -0.432,1.168 | drill 0.3 pad 0.61: VIA1 0,0.394; VIA2 0,-0.394
CON_OST_302-S101 = drill 1.194: 1 -5.08,-1.27; 2 -5.08,1.27; 3 -2.54,-1.27; 4 -2.54,1.27; 5 0,-1.27; 6 0,1.27; 7 2.54,-1.27; 8 2.54,1.27; 9 5.08,-1.27; 10 5.08,1.27
JP1 = drill 0.914 long: 1 0,-1.27; 2 0,1.27
JP2_ROUND = drill 0.914 pad 1.778: 1 -2.54,0; 2 0,0; 3 2.54,0
JP5Q = drill 0.914 pad 1.778 octagon: 1 -5.08,-1.27; 2 -5.08,1.27; 3 -2.54,-1.27; 4 -2.54,1.27; 5 0,-1.27; 6 0,1.27; 7 2.54,-1.27; 8 2.54,1.27; 9 5.08,-1.27; 10 5.08,1.27
JP3Q = drill 0.914 pad 1.778 octagon: 1 -2.54,-1.27; 2 -2.54,1.27; 3 0,-1.27; 4 0,1.27; 5 2.54,-1.27; 6 2.54,1.27
JP8Q = drill 0.914 pad 1.778 octagon: 1 -8.89,-1.27; 2 -8.89,1.27; 3 -6.35,-1.27; 4 -6.35,1.27; 5 -3.81,-1.27; 6 -3.81,1.27; 7 -1.27,-1.27; 8 -1.27,1.27; 9 1.27,-1.27; 10 1.27,1.27; 11 3.81,-1.27; 12 3.81,1.27; 13 6.35,-1.27; 14 6.35,1.27; 15 8.89,-1.27; 16 8.89,1.27
R0402 = smd 0.7 x 0.9: 1 -0.65,0; 2 0.65,0
CHIP-LED0805 = smd 1.2 x 1.2: A 0,-1.05; C 0,1.05
3.2X2.5_KX-7 = smd 1.3 x 1.1: 1 -1.15,-0.9; 2 1.15,-0.9; 3 1.15,0.9; 4 -1.15,0.9
R0603 = smd 0.95 x 0.95: 1 -0.725,0; 2 0.725,0
R0402' = smd 0.6 x 0.7: 1 -0.5,0; 2 0.5,0
J502-ND-142-0701-881/886 = smd 5.08 x 1.143: 1 2.565,0 | smd 5.08 x 2.286: G@1 2.565,4.42; G@2 2.565,-4.42 | smd 5.08 x 2.286 bottom: G@3 2.565,4.42; G@4 2.565,-4.42
22-23-2021 = drill 1 long: 1 -1.27,0; 2 1.27,0

### Placement (x,y rotation side)
C1  21.75,31.27 90 top
C2  22.86,63.5 180 top
C3  24.61,21.59 90 top
C4  27.62,18.26 180 top
C5  27.78,27.78 0 top
C6  27.78,30.32 0 top
C7  28.57,67.63 270 top
C8  30.16,26.83 270 top
C9  30.16,28.89 270 top
C10  30.64,21.75 270 top
C11  32.38,26.35 180 top
C12  32.38,28.26 180 top
C13  33.18,18.26 225 top
C14  33.66,14.76 45 top
C15  35.24,37.31 0 top
C16  35.4,18.26 270 top
C17  35.4,33.18 0 top
C18  36.04,31.11 90 top
C19  36.35,14.45 180 top
C20  36.83,19.68 270 top
C21  37.47,33.18 0 top
C22  37.47,37.31 0 top
C23  37.94,31.11 90 top
C24  38.1,19.68 270 top
C25  38.58,14.45 0 top
C26  39.21,31.11 90 top
C27  39.53,18.26 270 top
C28  39.69,33.18 180 top
C29  39.69,37.31 180 top
C30  41.12,31.11 90 top
C31  41.75,33.18 180 top
C32  41.91,14.13 135 top
C33  41.91,37.31 180 top
C34  42.39,17.62 315 top
C35  43.18,18.41 315 top
C36  43.81,23.5 0 top
C37  43.81,29.05 0 top
C38  43.81,30.16 0 top
C39  45.72,44.13 180 top
C40  45.72,45.72 180 top
C41  45.72,51.75 180 top
C42  45.72,53.34 180 top
C43  46.2,29.69 270 top
C44  46.51,23.5 0 top
C45  46.67,18.89 135 top
C46  47.62,67.63 270 top
C47  49.53,22.23 180 top
C48  49.69,29.05 0 top
C49  54.61,42.86 0 top
C50  54.61,44.45 0 top
C51  54.61,50.48 0 top
C52  54.61,52.07 0 top
C53  73.03,30.64 0 top
C54  73.03,33.18 0 top
C55  73.03,35.72 0 top
C56  54.61,46.04 0 top
C57  54.61,53.66 0 top
C100  33.97,25.72 180 bottom
C101  33.97,27.3 180 bottom
C102  33.97,28.89 180 bottom
C103  36.2,29.53 270 bottom
C104  36.67,21.27 90 bottom
C105  37.78,29.53 270 bottom
C106  38.26,21.27 90 bottom
C107  39.37,29.53 270 bottom
C108  40.96,29.53 270 bottom
C109  42.23,22.54 0 bottom
C110  42.23,24.13 0 bottom
C111  42.23,25.72 0 bottom
C112  42.23,27.3 0 bottom
D1  53.5,61.44 90 top
D2  58.74,61.44 90 top
H1  3.81,3.81 0 top
H2  3.81,72.39 0 top
H3  72.39,3.81 0 top
H4  72.39,72.39 0 top
IC1  38.1,25.4 0 top
IC2  50.16,43.18 0 top
IC3  50.16,50.8 0 top
JP1  6.03,52.07 270 top
JP2  7.62,25.4 270 top
JP3  8.89,15.88 180 top
JP4  8.89,19.05 180 top
JP5  8.89,22.23 180 top
JP6  22.86,50.8 270 top
JP7  38.1,65.09 0 top
JP8  66.67,33.18 90 top
JP9  67.94,11.59 0 top
JP10  67.94,14.76 0 top
JP11  67.94,17.94 0 top
JP12  67.94,21.11 0 top
JP13  67.94,24.29 0 top
JP14  69.06,50.96 90 top
L1  27.94,26.51 0 top
L2  27.94,29.05 0 top
L3  34.77,35.24 90 top
L4  36.83,16.51 270 top
L5  36.99,35.24 90 top
L6  38.1,16.51 270 top
L7  40.16,35.24 90 top
L8  42.39,35.24 90 top
L9  45.09,31.43 180 top
L10  49.53,23.5 180 top
LED1  9.37,31.91 270 top
LED2  9.37,34.77 270 top
Q1  27.62,21.75 180 top
R1  5.56,31.91 180 top
R2  5.56,34.77 180 top
R3  5.87,39.37 0 top
R4  15.24,19.05 90 top
R5  15.24,22.23 270 top
R6  16.99,15.88 0 top
R7  16.99,19.05 270 top
R8  16.99,22.23 90 top
R9  18.73,19.05 90 top
R10  18.73,22.23 270 top
R11  20.16,29.05 180 top
R12  22.86,59.69 0 top
R13  22.86,61.59 0 top
R14  23.34,29.05 0 top
R15  DNP  [R0402']  31.59,16.03 315 top
R16  DNP  [R0402']  32.38,16.83 135 top
R17  0R JUMPER 0402  [R0402']  34.61,19.68 45 top
R18  36.83,58.42 90 top
R19  38.73,58.42 270 top
R20  0R JUMPER 0402  [R0402']  40.96,19.05 135 top
R21  0R JUMPER 0402  [R0402']  41.75,19.84 135 top
R22  DNP  [R0402']  43.18,16.19 45 top
R23  DNP  [R0402']  43.97,15.4 225 top
R24  DNP  [R0402']  44.61,17.62 225 top
R25  DNP  [R0402']  45.4,16.83 45 top
R26  45.72,40.64 0 top
R27  45.72,42.23 180 top
R28  45.72,48.26 0 top
R29  45.72,49.85 180 top
R30  49.69,27.62 0 top
R31  54.61,41.27 180 top
R32  54.61,48.9 180 top
R33  58.42,13.02 90 top
R34  58.42,16.19 90 top
R35  58.42,19.37 90 top
R36  58.42,22.54 90 top
R37  60.17,13.02 90 top
R38  60.17,16.19 90 top
R39  60.17,19.37 90 top
R40  60.17,22.54 90 top
R41  60.17,24.92 180 top
R42  60.17,26.51 0 top
R43  61.91,13.02 90 top
R44  61.91,16.19 90 top
R45  61.91,19.37 90 top
R46  61.91,22.54 90 top
R47  63.66,42.07 0 top
R48  63.66,44.61 0 top
R49  63.66,47.15 0 top
R50  63.66,49.69 0 top
R51  63.66,52.23 0 top
R52  63.66,54.77 0 top
R53  63.66,57.31 0 top
R54  63.66,59.85 0 top
X1  19.05,1.59 90 top
X2  28.57,74.61 270 top
X3  38.1,1.59 90 top
X4  47.62,74.61 270 top
X5  57.15,1.59 90 top
X6  61.59,71.75 0 top

### Tracks (layer width: path | path; a pad name or v marks a point on that pad's centre or on a via)
DECAP_DIG  (via drill 0.35)
  Top 0.254: IC1.3 34.13,27.15 33.57,27.71 33.57,28.73 33.18,29.12 v33.18,29.84
  Bottom 0.406: v33.18,29.84 33.18,28.96 C102.1
DECAP_LDO  (via drill 0.35)
  Top 0.254: IC1.28 41.93,24.15 42.23,24.45 v43.97,24.45
  Bottom 0.406: v43.97,24.45 43.27,24.45 C110.1
DECAP_PLL  (via drill 0.35)
  Top 0.254: IC1.35 43.84,27.65 v44.13,27.94
  Bottom 0.406: v44.13,27.94 44.13,26.1 43.75,25.72 C111.1
EXT_VDD
  Top 0.813: JP1.5 3.02,50.32 3.02,45.24 5.15,43.11 R3.1
GND  (via drill 0.35)
  Top 0.229: X1.G@2 24.13,3.49 v24.13,3.17 | X3.G@1 33.81,4.02 33.81,3.65 v34.29,3.17 | X3.G@2 43.18,3.49 v43.18,3.17 | X5.G@1 52.07,3.49 v52.07,3.17 | X5.G@2 62.23,3.49 v62.23,3.17 | X2.G@4 24.77,72.66 v24.77,73.03 | X2.G@3 32.38,72.66 v32.38,73.03 | X4.G@4 42.55,72.71 v42.55,73.03 | X4.G@3 51.44,72.66 v51.44,73.03 | IC1.49
  Top 0.254: Q1.4 30.46,20.85 C10.2 v30.64,20 | Q1.2 24.78,22.65 24.64,22.51 | 24.64,22.51 24.48,22.35 24.56,22.27 C3.2 | v24.61,23.34 24.61,22.54 24.64,22.51 | R10.1 v18.73,23.97 | R9.1 v18.73,17.3 | R33.1 58.35,12.22 v57.47,12.22 | v57.47,15.4 58.35,15.4 R34.1 | v57.47,18.57 58.35,18.57 R35.1 | v57.47,21.75 58.35,21.75 R36.1 | C37.2 v45.09,29.05 | C38.2 v45.09,30.16 | C43.2 v46.2,28.42 | C4.2 v26.19,18.26 | C12.2 v31.11,28.26 | C11.2 v31.11,26.35 | C36.2 v45.09,23.5 | C44.2 v47.78,23.5 | C47.2 v48.26,22.23 | IC3.PAD1 49.73,49.97 IC3.VIA2 50.6,49.97 IC3.PAD2 | IC3.PAD4 49.73,51.63 IC3.VIA1 | IC3.PAD3 50.6,51.23 IC3.PAD | IC2.PAD1 49.73,42.35 IC2.VIA2 50.6,42.35 IC2.PAD2 | IC2.PAD4 49.73,44.01 IC2.VIA1 50.6,44.01 IC2.PAD3
  Top 0.305: IC2.4 47.92,42.2 v47.62,41.91 | IC3.4 47.92,49.83 v47.62,49.53 | C20.2 36.99,19.03 v36.99,18.41 | C24.2 37.94,19.03 v37.94,18.41 | R22.1 v42.23,15.24 41.56,14.57 C32.2 | R24.1 v45.56,18.57 46.23,19.25 C45.2 | X1.G@1 13.99,4.15 v13.97,4.13 | v35.72,15.24 35.72,14.58 C19.2 | v39.21,15.24 39.21,14.58 C25.2 | C27.2 v39.53,16.99 | C16.2 v35.4,16.99 | C18.2 v36.04,32.38 36.04,33.04 C17.2 | C23.2 v37.94,32.38 37.94,33.16 C21.2 | C26.2 v39.21,32.38 39.21,33.16 C28.2 | C30.2 v41.12,32.38 41.12,33.04 C31.2 | C33.2 41.41,36.49 v41.27,36.35 | C29.2 39.19,36.49 v39.05,36.35 | C22.2 37.97,36.49 v38.1,36.35 | C15.2 35.74,36.49 v35.88,36.35 | v31.11,28.26 30.3,28.26 C9.2 | v31.11,26.35 30.19,26.35 C8.2 | R16.1 v33.34,15.88 34.01,15.2 C14.2 | R16.1
  Top 0.406: R26.2 v47.62,40.64 | v43.81,45.72 C40.2 | C39.2 v43.81,44.13 | C49.2 v56.52,42.86 | C50.2 v56.52,44.45 | C41.2 v43.81,51.75 | C42.2 v43.81,53.34 | R28.2 v47.62,48.26 | C52.2 v56.52,52.07 | C51.2 v56.52,50.48 | C53.2 v74.93,30.64 | C54.2 v74.93,33.18 | C55.2 v74.93,35.72 | C48.2 v51.59,29.05 | v29.05,30.32 C6.2 | v29.05,27.78 C5.2 | C1.2 v21.75,33.02 | X1.G@2 23.44,4.13 v22.86,4.13 | X3.G@2 42.49,4.13 v41.91,4.13 | 33.6,4.13 v33.02,4.13 | 52.65,4.13 v52.07,4.13 | X5.G@2 61.54,4.13 v60.96,4.13 | 52.02,72.07 v51.44,72.07 | 43.13,72.07 v42.55,72.07 | 32.97,72.07 v32.38,72.07 | 24.08,72.07 v23.5,72.07 | R19.1 v38.73,60.17 | v20.95,63.5 C2.2 | IC3.PAD IC3.VIA2 | IC2.PAD IC2.VIA2 | C56.2 v56.52,46.04 | C57.2 v56.52,53.66
  other vias: 15.24,2.22 15.24,3.17 15.24,4.13 15.24,5.08 15.24,6.03 13.97,6.03 13.97,5.08 13.97,3.17 13.97,2.22 22.86,2.22 22.86,3.17 22.86,5.08 22.86,6.03 24.13,2.22 24.13,4.13 24.13,5.08 24.13,6.03 41.91,2.22 41.91,3.17 41.91,5.08 41.91,6.03 43.18,2.22 43.18,4.13 43.18,5.08 43.18,6.03 33.02,2.22 33.02,3.17 33.02,5.08 33.02,6.03 34.29,2.22 34.29,4.13 34.29,5.08 34.29,6.03 52.07,2.22 52.07,5.08 52.07,6.03 53.34,2.22 53.34,3.17 53.34,4.13 53.34,5.08 53.34,6.03 60.96,2.22 60.96,3.17 60.96,5.08 60.96,6.03 62.23,2.22 62.23,4.13 62.23,5.08 62.23,6.03 51.44,70.17 51.44,71.12 51.44,73.98 52.7,70.17 52.7,71.12 52.7,72.07 52.7,73.03 52.7,73.98 42.55,70.17 42.55,71.12 42.55,73.98 43.81,70.17 43.81,71.12 43.81,72.07 43.81,73.03 43.81,73.98 32.38,70.17 32.38,71.12 32.38,73.98 33.66,70.17 33.66,71.12 33.66,72.07 33.66,73.03 33.66,73.98 23.5,70.17 23.5,71.12 23.5,73.03 23.5,73.98 24.77,70.17 24.77,71.12 24.77,72.07 24.77,73.98 38.1,25.4 36.51,25.4 36.51,26.99 38.1,26.99 39.69,26.99 39.69,25.4 38.1,23.81 39.69,23.81 36.51,23.81 26.51,32.23 14.76,33.81 14.76,30.8 16.51,35.4 13.18,33.81 13.18,40.64 14.76,40.64 13.18,30.8 11.59,30.8 11.59,33.81 11.59,40.64 16.35,40.64 49.37,18.89 49.37,15.24 50.96,18.89 50.96,15.24 47.78,16.51 3.02,43.81
  pour Route2: -0.32,-0.32 -0.32,76.52 76.52,76.52 76.52,-0.32
  pour Bottom: 0,0 0,76.2 76.2,76.2 76.2,0
GPIO0/SYNC
  Top 0.254: IC1.12 34.4,22.65 30.96,19.21 22.54,19.21 19.21,15.88 R6.2 17.71,14.38 16.99,13.65 4.45,13.65 1.43,16.67 1.43,53.82 JP1.1
GPIO0_JUMPER
  Top 0.254: JP3.2 10.48,14.29 12.77,14.29 14.36,15.88 R6.1
GPIO1
  Top 0.254: R43.1 61.19,13.02 60.89,13.02 R37.2 R33.2 53.57,13.74 47.15,20.16 43.18,20.16 41.91,21.43 41.27,21.43 40.85,21.86 IC1.24
GPIO1_JUMPER
  Top 0.254: R37.1 60.17,12.22 60.96,11.43 63.34,11.43 64.77,10 66.36,10 JP9.2
GPIO2
  Top 0.254: R44.1 61.19,16.19 60.89,16.19 R38.2 R34.2 57.38,16.92 55.72,18.57 55.72,22.38 52.95,25.15 IC1.30
GPIO2_JUMPER
  Top 0.254: R38.1 61.03,14.61 63.34,14.61 64.77,13.18 66.36,13.18 JP10.2
GPIO3
  Top 0.254: R45.1 61.19,19.37 60.89,19.37 R39.2 R35.2 57.54,20.09 56.52,21.11 56.52,22.7 53.57,25.65 IC1.31
GPIO3_JUMPER
  Top 0.254: R39.1 61.03,17.78 63.34,17.78 64.77,16.35 66.36,16.35 JP11.2
GPIO4
  Top 0.254: R46.1 61.19,22.54 60.89,22.54 R40.2 R36.2 56.99,23.27 54.11,26.15 IC1.32
GPIO4_JUMPER
  Top 0.254: R40.1 61.03,20.95 63.34,20.95 64.77,19.53 66.36,19.53 JP12.2
GPIO5
  Top 0.254: IC1.33 59.3,26.65 R42.1
GPIO5_JUMPER  (via drill 0.35)
  Top 0.254: JP13.2 66.36,25.88 61.53,25.88 R42.2
  Top 0.406: R54.1 R53.1 R52.1 R51.1 R50.1 R49.1 R48.1 R47.1 62.93,41.05 v63.02,40.96
  Bottom 0.406: v63.02,40.96 63.34,40.64 69.22,40.64 70.17,39.69 70.17,26.51 JP13.2
GPIO5_SEL_1_2
  Top 0.406: JP14.2 R47.2
GPIO5_SEL_3_4
  Top 0.406: R48.2 JP14.4
GPIO5_SEL_5_6
  Top 0.406: JP14.6 R49.2
GPIO5_SEL_7_8
  Top 0.406: R50.2 JP14.8
GPIO5_SEL_9_10
  Top 0.406: JP14.10 R51.2
GPIO5_SEL_11_12
  Top 0.406: R52.2 JP14.12
GPIO5_SEL_13_14
  Top 0.406: JP14.14 R53.2
GPIO5_SEL_15_16
  Top 0.406: R54.2 JP14.16
HW_SW_CTRL
  Top 0.254: IC1.9 24.31,24.15 20.16,20 18.96,20 R9.2 R7.1 R4.2 13.4,19.77 12.54,20.64 3.81,20.64 2.7,21.75 2.7,35.72 | 2.7,35.72 3.33,36.35 17.46,36.35 25.72,44.61 25.72,46.67 JP6.8 | JP1.3 2.06,51.91 2.06,36.35 2.7,35.72
HWCTRL_JUMPER
  Top 0.254: JP4.2 10.48,17.46 14.38,17.46 R4.1
LDO_PVCORE_EN
  Top 0.305: IC3.5 52.95,49.83 R32.2
LDO_PVCORE_FB
  Top 0.305: IC3.3 47.07,50.48 R29.1 46.45,49.71 R28.1
LDO_PVCORE_SS
  Top 0.305: IC3.6 C51.1
LDO_PVDDIO_EN
  Top 0.305: IC2.5 52.95,42.2 R31.2
LDO_PVDDIO_FB
  Top 0.305: IC2.3 47.07,42.85 R27.1 44.99,40.78 R26.1
LDO_PVDDIO_SS
  Top 0.305: IC2.6 51.65,42.86 C49.1
LF1
  Top 0.254: IC1.34 44.77,27.15 45.09,27.46 48.8,27.46 R30.1
  Top 0.305: R30.1 C48.1
LF_FRAC_N
  Top 0.406: C54.1 JP8.3
LF_INT_N\
  Top 0.406: C53.1 JP8.1
LF_NARROW
  Top 0.406: C55.1 JP8.5
LF_R
  Top 0.406: R30.2 62.39,27.62 JP8.2 JP8.4 JP8.6
N$7
  Top 0.406: LED1.A R1.1
N$8
  Top 0.406: LED2.A R2.1
OUT0_P
  Top 0.229: IC1.14 35.85,20.93 R17.2
OUT0_R_C_P
  Top 0.229: X1.1 19.05,8.15 arc-45 19.79,9.95 20.61,10.77 arc-45 22.4,11.51 25.31,11.51 arc45 27.1,12.25 R15.1 R16.2 32.1,17.18 C13.2
  pour Top (no thermals): 18.56,6.68 19.05,7.54 19.05,7.54 19.54,6.68
OUT0_R_P
  Top 0.229: R17.1 C13.1
OUT2_N
  Top 0.229: IC1.21 39.35,21.61 40.76,20.2 R21.2
OUT2_P
  Top 0.229: IC1.20 38.85,21.32 40.6,19.56 R20.2
OUT2_R_C_N
  Top 0.229: C35.2 44.26,17.34 R24.2 R25.1 51.94,9.58 arc45 52.84,9.21 55.2,9.21 arc-45 56.09,8.84 56.78,8.15 arc-45 57.15,7.25 X5.1
  pour Top (no thermals): 56.66,6.68 57.15,7.54 57.15,7.54 57.64,6.68
OUT2_R_C_P
  Top 0.229: X3.1 38.1,7.25 arc-45 38.47,8.15 39.16,8.84 arc-45 40.05,9.21 44.56,9.21 arc45 45.46,9.58 46.3,10.42 arc45 46.67,11.32 46.67,12.88 arc45 46.3,13.78 R23.1 R22.2 43.46,16.55 C34.2
  pour Top (no thermals): 37.61,6.68 38.1,7.54 38.1,7.54 38.59,6.68
OUT2_R_N
  Top 0.229: C35.1 R21.1
OUT2_R_P
  Top 0.229: C34.1 R20.1
PDN
  Top 0.254: IC1.13 34.54,22 30.8,18.26 C4.1 28.12,17.64 27.78,17.3 21.91,17.3 17.46,12.86 4.29,12.86 0.79,16.35 0.79,56.99 2.54,58.74 5.71,58.74 JP1.2
PP_P1V8_VDDO  (via drill 0.35)
  Top 0.305: R27.2 45.72,42.95 45.72,43.41 C39.1 | L4.2 36.83,14.47 C19.1 36.85,13.52 v36.83,13.49 | L6.2 38.1,14.47 C25.1 38.08,13.52 v38.1,13.49 | C45.1 47.03,18.45 v46.35,17.78 R25.2 | R23.2 43.53,15.04 43.53,14.96 v43.02,14.45 42.35,13.78 C32.1 | L3.2 34.77,37.28 C15.1 34.77,37.33 v34.77,38.26 | L5.2 36.99,37.28 C22.1 36.99,37.33 v36.99,38.26 | L7.2 40.19,35.92 C29.1 40.19,38.23 v40.16,38.26 | L8.2 42.39,37.28 C33.1 42.41,38.23 v42.39,38.26 | R15.2 v32.54,15.08 | v32.54,15.08 | v32.54,15.08 33.22,14.41 C14.1
  other vias: 47.62,45.72 48.58,45.72 49.53,45.72 50.48,45.72 47.62,46.67 48.58,46.67 49.53,46.67 50.48,46.67
  pour Route15: 28.57,15.56 31.59,12.54 42.86,12.54 47.47,17.14 47.47,18.1 45.88,19.68 45.09,19.68 41.59,16.19 34.13,16.19 33.18,17.14 33.18,22.07 31.11,24.13 31.11,33.02 33.34,35.24 42.39,35.24 46.86,39.71 56.38,39.71 57.78,41.12 57.78,45.56 56.36,46.99 39.37,46.99 28.57,36.2
  pour Top: 46.04,46.51 46.04,43.5 49.21,43.5 49.21,44.93 49.53,45.24 50.64,45.24 50.8,45.4 50.8,46.83 50.64,46.99 46.51,46.99
PP_P3V3_PLL_CORE  (via drill 0.35)
  Top 0.254: v62.87,13.81 61.98,13.81 R43.2 | v62.87,16.99 61.98,16.99 R44.2 | v62.87,20.16 61.98,20.16 R45.2 | v62.87,23.34 61.98,23.34 R46.2 | v16.99,23.97 R8.2 | v16.99,17.3 R7.2 | R41.2 v58.42,24.92
  Top 0.305: R29.2 45.72,50.57 45.72,51.03 C41.1 | v55.24,37.31 55.24,41.19 R31.1
  Top 0.406: v47.15,30.32 46.33,30.32 C43.1 46.2,30.97 L9.1 | C6.1 L2.1 v26.35,29.05 | C5.1 L1.1 v26.35,26.51 | R18.2 v36.83,60.17 | v51.12,23.5 L10.1 50.03,23.34 C47.1 | R13.2 C2.1 v24.77,63.5 | R13.2 R12.2 v24.77,59.69 | R13.2 v24.77,61.59
  other vias: 8.1,38.89 9.05,38.89 8.1,39.85 9.05,39.85 47.62,53.34 47.62,54.29 48.58,53.34 48.58,54.29 49.53,54.29 50.48,54.29 49.53,53.34 50.48,53.34
  pour Route15 (rank 2): 5.24,14.13 17.78,14.13 26.99,23.34 26.99,29.37 26.67,29.69 25.72,29.69 25.4,29.37 25.4,26.67 24.45,25.72 11.59,25.72 10.64,26.67 10.64,55.24 14.45,59.05 50.16,59.05 50.48,59.37 50.48,66.67 51.44,67.63 55.56,67.63 56.36,66.83 56.36,64.45 54.29,62.39 54.29,55.56 53.34,54.61 39.37,54.61 38.73,53.98 38.73,48.58 39.37,47.94 57.15,47.94 59.05,46.04 59.05,40.48 56.99,38.42 47.31,38.42 45.72,36.83 45.59,27.43 51.59,21.43 51.59,12.06 53.18,10.48 56.2,10.48 58.58,8.1 73.34,8.1 73.82,8.57 73.82,64.45 69.37,68.9 6.35,68.9 1.59,64.14 1.59,50.16 4.76,46.99 4.76,14.61
  pour Top: 6.35,40.32 6.35,38.42 6.67,38.1 9.21,38.1 9.53,38.42 9.53,40.32 9.21,40.64 6.67,40.64
  pour Top: 46.04,54.13 46.04,51.12 49.21,51.12 49.21,52.55 49.53,52.86 50.64,52.86 50.8,53.02 50.8,54.45 50.64,54.61 46.51,54.61
PRIREF_N
  Top 0.229: IC1.7 22.42,25.15 arc-45 21.97,25.34 19.62,27.68 arc-45 19.44,28.13 R11.2 19.44,33.24 arc-45 20.18,35.03 32.59,47.45 arc45 33.34,49.24 33.34,50.45 arc45 32.59,52.25 29.32,55.52 arc-45 28.57,57.32 28.57,60.7 arc-45 28.76,61.15 29.02,61.41 arc45 29.21,61.86 29.21,62.23 arc90 28.57,62.87 28.42,62.87 arc-90 27.78,63.5 arc-90 28.42,64.14 28.57,64.14 arc90 29.21,64.77 29.21,64.82 arc45 29.02,65.27 28.76,65.54 arc-45 28.57,65.99 C7.2
PRIREF_P
  Top 0.229: C46.2 47.62,62.01 arc-45 46.88,60.22 38.84,52.18 arc45 38.1,50.38 38.1,48.99 arc-45 37.36,47.2 24.8,34.65 arc45 24.06,32.85 R14.2 24.06,28 arc-45 23.97,27.78 23.91,27.71 arc-45 23.68,27.62 22.36,27.62 arc45 22.13,27.53 22,27.4 arc45 21.91,27.17 21.91,26.48 arc45 22,26.26 22.52,25.74 arc45 22.74,25.65 IC1.6
PRIREF_R_N
  Top 0.254: X2.1 C7.1
PRIREF_R_P
  Top 0.254: X4.1 C46.1
PRIREF_VCM
  Top 0.406: R11.1 21.75,29.91 | R14.1 21.75,29.91 | 21.75,29.91 C1.1 22.45,30.55 22.7,30.8 22.7,35.08 35.72,48.1 35.72,62.71 JP7.2
PRIREF_VCM_DIVIDER
  Top 0.406: R18.1 R19.2 39.44,57.7 39.85,58.1 39.85,64.29 JP7.3
PULLUP_GPIO5
  Top 0.254: JP13.3 68.9,22.7 64.86,22.7 62.64,24.92 R41.1
REFSEL  (via drill 0.35)
  Top 0.254: IC1.8 24.02,24.65 21.67,22.3 | 21.67,22.3 20.86,21.5 R10.2 R8.1 R5.2 | 21.67,22.3 17.62,26.35 v13.65,26.35
  Bottom 0.254: v13.65,26.35 12.38,27.62 12.38,49.53 JP1.4
REFSEL_JUMPER
  Top 0.254: R5.1 14.45,22.95 13.58,23.81 10.48,23.81 JP5.2
SCL  (via drill 0.35)
  Top 0.254: IC1.26 42.1,23.15 43.5,21.75 v45.24,21.75 | JP1.9 6.03,48.26 8.89,48.26 22.14,61.51 R13.1
  Top 0.305: JP1.9 10.16,41.59 20,41.59 JP6.10
  Bottom 0.254: v45.24,21.75 47.62,21.75 50.16,19.21 50.16,14.92 45.09,9.84 4.45,9.84 2.22,12.06 2.22,44.45 JP1.9
SDA  (via drill 0.35)
  Top 0.254: IC1.25 41.8,22.65 43.5,20.95 v44.45,20.95 | JP1.10 10.16,46.99 22.14,58.97 R12.1
  Top 0.305: JP6.9 11.43,45.72 10.16,46.99
  Bottom 0.254: v44.45,20.95 46.99,20.95 48.58,19.37 48.58,14.61 44.93,10.95 4.6,10.95 3.17,12.38 3.17,42.86 JP1.10
SECREF_N
  Top 0.254: Q1.1 28.95,22.47 C10.1 31.32,23.15 IC1.11
SECREF_P
  Top 0.254: C3.1 26.46,20.86 Q1.3 26.56,20.85 27.62,21.91 27.62,23.34 27.94,23.65 30.32,23.65 IC1.10
STATUS0  (via drill 0.35)
  Top 0.254: IC1.1 34.7,30.39 32.07,33.02 v27.3,33.02
  Top 0.406: v15.56,34.77 LED2.C
  Bottom 0.406: JP6.7 15.56,42.23 v15.56,34.77 18.26,32.07 25.08,32.07 26.04,33.02 v27.3,33.02
STATUS1  (via drill 0.35)
  Top 0.254: IC1.2 34.26,27.65 34.05,27.86 34.05,30.24 32.7,31.59 v27.3,31.59
  Top 0.406: v15.4,31.91 LED1.C
  Bottom 0.406: v27.3,31.59 26.35,30.64 16.67,30.64 v15.4,31.91 13.97,33.34 13.97,43.18 JP6.5
STATUS_LED_PWR
  Top 0.406: R2.2 R1.2 4.83,27.71 6.35,26.19 JP2.1
VDD_DIG  (via drill 0.35)
  Top 0.254: IC1.4 33.7,26.65 32.88,27.46 C12.1 32.7,28.44 32.7,28.57 32.07,29.21 v31.91,29.21
  Top 0.305: L2.2 28.75,29.21 29.98,29.21 C9.1 30.34,29.21 v31.91,29.21
  Bottom 0.406: C101.1 33.25,27.39 31.91,28.73 v31.91,29.21
VDD_IN  (via drill 0.35)
  Top 0.254: IC1.5 33.09,26.15 C11.1 32.7,26.54 32.7,26.67 32.07,27.3 v31.91,27.3
  Top 0.305: L1.2 29.02,26.94 29.77,26.94 C8.1 30.19,27.3 v31.91,27.3
  Bottom 0.406: v31.91,27.3 31.91,26.83 33.02,25.72 C100.1
VDD_LDO  (via drill 0.35)
  Top 0.254: IC1.27 43.16,23.65 C36.1
  Top 0.406: L10.2 48.88,23.83 48.26,24.45 46.35,24.45 46.01,24.11 C44.1 46.01,22.84 45.72,22.54 v43.97,22.54 43.66,22.54 43.31,22.88 C36.1
  Bottom 0.406: C109.1 v43.97,22.54
VDD_PLL  (via drill 0.35)
  Top 0.254: C37.1 43.31,29.19 | 43.31,29.19 C38.1 43.31,30.93 43.81,31.43 L9.2 | IC1.36 42.28,28.15 v42.55,28.42 43.31,29.19
  Bottom 0.406: C112.1 42.95,28.01 v42.55,28.42
VDDO_01  (via drill 0.35)
  Top 0.254: 36.9,20.25 C20.1 37.15,20.5 37.15,20.8 37.85,21.5 IC1.18
  Top 0.305: L4.1 36.17,17.82 36.17,18.73 | 36.9,20.25 36.76,20.25 36.17,19.66 36.17,19.53 | 36.17,18.73 36.17,19.53 | C16.1 36.15,18.76 36.17,18.73 | v35.88,19.53 36.17,19.53
  Bottom 0.406: C104.1 36.67,20.32 v35.88,19.53
VDDO_4  (via drill 0.35)
  Top 0.254: IC1.37 40.85,30.35 C30.1
  Top 0.305: C30.1 41.89,30.61 42.07,30.8 v42.07,31.27 42.07,33 C31.1 42.25,34.46 L8.1
  Bottom 0.305: C108.1 41.05,30.25 v42.07,31.27
VDDO_5  (via drill 0.35)
  Top 0.254: IC1.40 39.35,30.48 C26.1
  Top 0.305: C26.1 39.82,30.61 40.16,30.96 v40.16,31.27 40.16,33.16 C28.1 40.19,34.57 L7.1
  Bottom 0.305: C107.1 40.16,31.05 v40.16,31.27
VDDO_6  (via drill 0.35)
  Top 0.254: IC1.43 37.85,30.52 C23.1
  Top 0.305: C23.1 37.33,30.61 36.99,30.96 v36.99,31.27 36.99,33.16 C21.1 36.97,34.57 L5.1
  Bottom 0.305: C105.1 36.99,31.05 v36.99,31.27
VDDO_7  (via drill 0.35)
  Top 0.254: IC1.46 36.35,30.3 C18.1
  Top 0.305: C18.1 35.42,30.61 35.08,30.96 v35.08,31.27 35.08,33 C17.1 34.9,34.46 L3.1
  Bottom 0.305: C103.1 36.1,30.25 v35.08,31.27
VDDO_23  (via drill 0.35)
  Top 0.254: IC1.19 38.35,20.43 C24.1
  Top 0.305: L6.1 38.76,17.82 38.76,18.73 | C24.1 38.23,20.18 38.76,19.66 38.76,19.53 | 38.76,18.73 38.76,19.53 | C27.1 38.78,18.76 38.76,18.73 | v39.05,19.53 38.76,19.53
  Bottom 0.406: C106.1 38.26,20.32 v39.05,19.53
VIN
  pour Top: 51.59,51.12 51.59,55.09 51.28,55.4 51.28,60.96 51.59,61.28 60.48,61.28 60.8,60.96 60.8,49.69 56.83,45.72 54.77,45.72 54.45,45.4 54.45,43.97 53.34,43.97 52.86,43.5 51.12,43.5 51.12,44.45 51.59,44.93 51.59,47.78 51.91,48.1 53.5,48.1 53.5,49.21 53.66,49.37 56.52,49.37 57.31,50.16 57.31,52.86 56.99,53.18 54.77,53.18 54.29,52.7 54.29,51.59 53.34,51.59 52.86,51.12
VIN_EXT
  pour Top: 56.83,61.91 56.52,62.23 56.52,75.56 56.83,75.88 64.93,75.88 65.25,75.56 65.25,66.52 60.64,61.91
VIN_MLB  (via drill 0.35)
  other vias: 52.55,65.56 53.5,65.56 54.45,65.56 52.55,66.52 53.5,66.52 54.45,66.52 51.59,65.56 51.59,66.52 55.4,66.52 55.4,65.56
  pour Route15: 20.32,54.93 20.64,54.61 38.1,54.61 39.05,55.56 53.02,55.56 53.34,55.88 53.34,62.55 55.72,64.93 55.72,66.67 55.4,66.99 51.59,66.99 51.28,66.67 51.28,58.42 50.96,58.1 21.59,58.1 20.32,56.83
  pour Top: 51.59,61.91 51.28,62.23 51.28,66.67 51.59,66.99 55.4,66.99 55.72,66.67 55.72,62.23 55.4,61.91

### Text on the board
tPlace: - | + | (7V MAX) | 1GHz PLL Clock Source Rev. 1.0 / kramnik@berkeley.edu / vlada@berkeley.edu | 1.4V | 1.2V | 1.0V | 0.8V | 0.6V | 0.4V | 0.2V | 0.0V | NARROW | FRAC-N | INT-N | HI | LO | (NC = MID) | (NC = MID) | LO | HI